# EAGLE schematic icyradio-main (EAGLE 9.6.2), part 1 of 3
CREVISION: 2; DESIGNER: Joao Silva

## Sheet 1 of 13: Compute Module 4
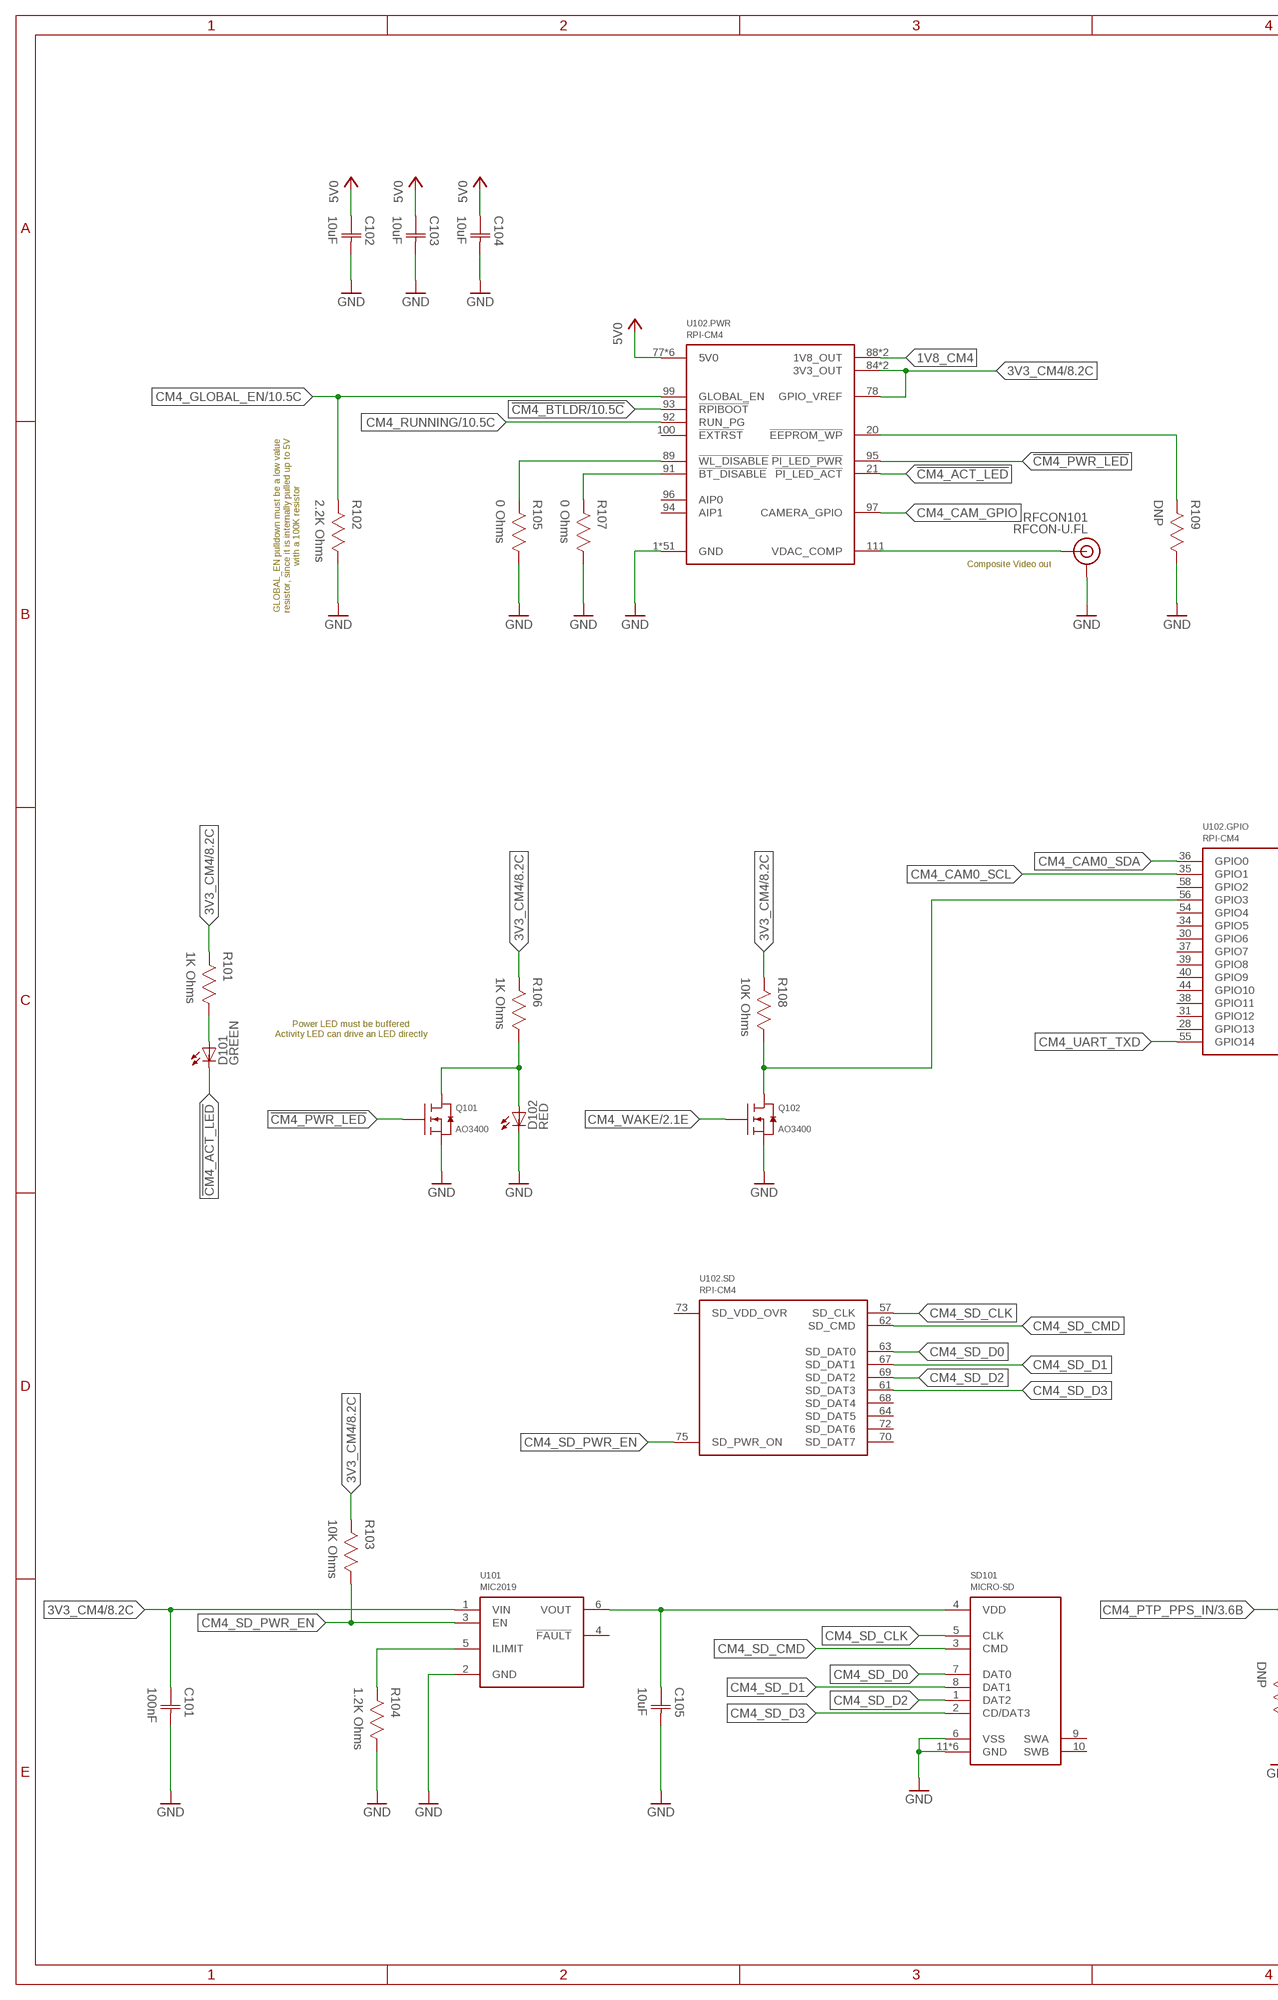
[diagram p0: schematic, sheet 1, part 1 of 2]
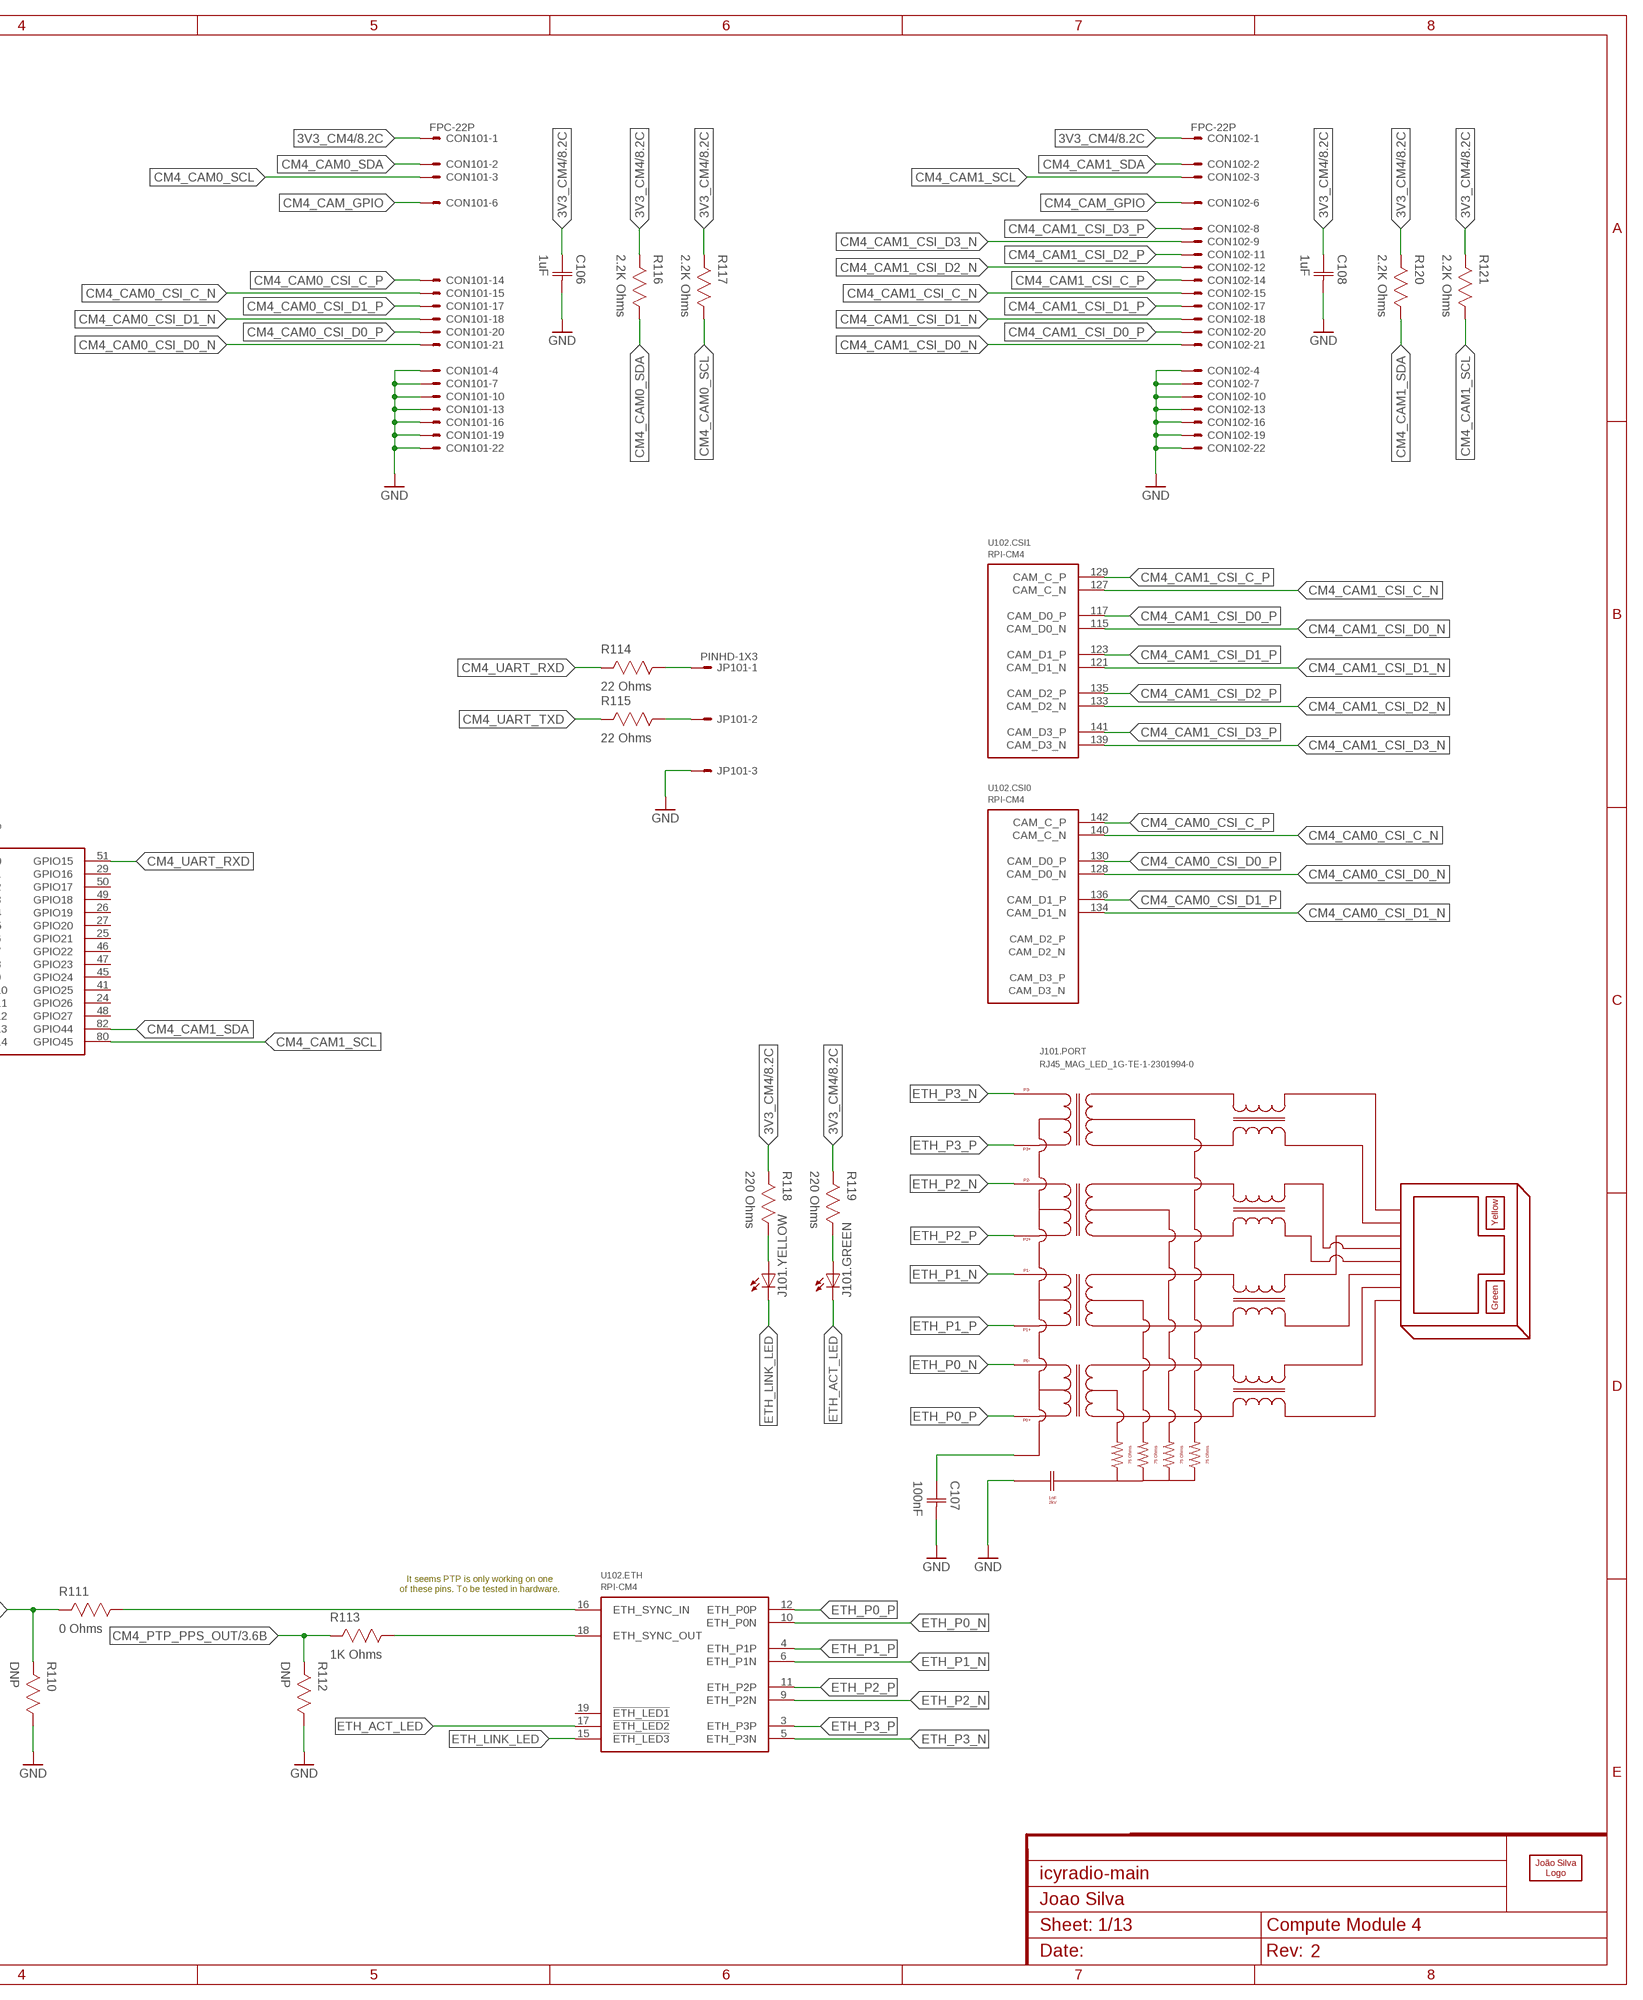
[diagram p1: schematic, sheet 1, part 2 of 2]

### Parts
C101  100nF  CAPACITOR-0402  [CAP0402]
C102  10uF  CAPACITOR-0603  [CAP0603]
C103  10uF  CAPACITOR-0603  [CAP0603]
C104  10uF  CAPACITOR-0603  [CAP0603]
C105  10uF  CAPACITOR-0402  [CAP0402]
C106  1uF  CAPACITOR-0402  [CAP0402]
C107  100nF  CAPACITOR-0402  [CAP0402]
C108  1uF  CAPACITOR-0402  [CAP0402]
CON101  FPC-22P  [FPC-22P]
CON102  FPC-22P  [FPC-22P]
D101  LED0603  [0603]
D102  LED0603  [0603]
J101  RJ45_MAG_LED_1G-TE-1-2301994-0  [TE-1-2301994-0]
JP101  PINHD-1X3  [1X03]
LOGO101  JS-10MM  [JS_10MM]
Q101  AO3400  [SOT23]
Q102  AO3400  [SOT23]
R101  1K Ohms  RESISTOR-0402  [RES0402]
R102  2.2K Ohms  RESISTOR-0402  [RES0402]
R103  10K Ohms  RESISTOR-0402  [RES0402]
R104  1.2K Ohms  RESISTOR-0402  [RES0402]
R105  0 Ohms  RESISTOR-0402  [RES0402]
R106  1K Ohms  RESISTOR-0402  [RES0402]
R107  0 Ohms  RESISTOR-0402  [RES0402]
R108  10K Ohms  RESISTOR-0402  [RES0402]
R109  DNP  RESISTOR-0402  [RES0402]
R110  DNP  RESISTOR-0402  [RES0402]
R111  0 Ohms  RESISTOR-0402  [RES0402]
R112  DNP  RESISTOR-0402  [RES0402]
R113  1K Ohms  RESISTOR-0402  [RES0402]
R114  22 Ohms  RESISTOR-0402  [RES0402]
R115  22 Ohms  RESISTOR-0402  [RES0402]
R116  2.2K Ohms  RESISTOR-0402  [RES0402]
R117  2.2K Ohms  RESISTOR-0402  [RES0402]
R118  220 Ohms  RESISTOR-0402  [RES0402]
R119  220 Ohms  RESISTOR-0402  [RES0402]
R120  2.2K Ohms  RESISTOR-0402  [RES0402]
R121  2.2K Ohms  RESISTOR-0402  [RES0402]
RFCON101  RFCON-U.FL  [U.FL]
SD101  MICRO-SD  [TE-2201778-1]
U101  MIC2019  [SOT23-6]
U102  RPI-CM4  [RPI-CM4]

### Nets
1V8_CM4: U102.88(.PWR:1V8_OUT) U102.90(.PWR:1V8_OUT)
3V3_CM4: C101.1(C1) C106.1(C1) C108.1(C1) CON101.1 CON102.1 R101.2 R103.2 R106.2 R108.2 R116.2 R117.2 R118.2 R119.2 R120.2 R121.2 U101.1(VIN) U102.78(.PWR:GPIO_VREF) U102.84(.PWR:3V3_OUT) U102.86(.PWR:3V3_OUT) ; also sheet 8
3V3_CM4_SD: C105.1(C1) SD101.4(VDD) U101.6(VOUT)
5V0: C102.1(C1) C103.1(C1) C104.1(C1) U102.77(.PWR:5V0) U102.79(.PWR:5V0) U102.81(.PWR:5V0) U102.83(.PWR:5V0) U102.85(.PWR:5V0) U102.87(.PWR:5V0) ; also sheet 10,11,12
!CM4_ACT_LED: D101.C U102.21(.PWR:!PI_LED_ACT)
!CM4_BT_DIS: R107.2 U102.91(.PWR:!BT_DISABLE)
!CM4_BTLDR: U102.93(.PWR:!RPIBOOT) ; also sheet 10
!CM4_EE_WP: R109.2 U102.20(.PWR:!EEPROM_WP)
!CM4_PWR_LED: Q101.1(G) U102.95(.PWR:!PI_LED_PWR)
!CM4_WL_DIS: R105.2 U102.89(.PWR:!WL_DISABLE)
CM4_CAM0_CSI_C_N [CPWG 100 Ohm Differential]: CON101.15 U102.140(.CSI0:CAM_C_N)
CM4_CAM0_CSI_C_P [CPWG 100 Ohm Differential]: CON101.14 U102.142(.CSI0:CAM_C_P)
CM4_CAM0_CSI_D0_N [CPWG 100 Ohm Differential]: CON101.21 U102.128(.CSI0:CAM_D0_N)
CM4_CAM0_CSI_D0_P [CPWG 100 Ohm Differential]: CON101.20 U102.130(.CSI0:CAM_D0_P)
CM4_CAM0_CSI_D1_N [CPWG 100 Ohm Differential]: CON101.18 U102.134(.CSI0:CAM_D1_N)
CM4_CAM0_CSI_D1_P [CPWG 100 Ohm Differential]: CON101.17 U102.136(.CSI0:CAM_D1_P)
CM4_CAM0_SCL: CON101.3 R117.1 U102.35(.GPIO:GPIO1)
CM4_CAM0_SDA: CON101.2 R116.1 U102.36(.GPIO:GPIO0)
CM4_CAM1_CSI_C_N [CPWG 100 Ohm Differential]: CON102.15 U102.127(.CSI1:CAM_C_N)
CM4_CAM1_CSI_C_P [CPWG 100 Ohm Differential]: CON102.14 U102.129(.CSI1:CAM_C_P)
CM4_CAM1_CSI_D0_N [CPWG 100 Ohm Differential]: CON102.21 U102.115(.CSI1:CAM_D0_N)
CM4_CAM1_CSI_D0_P [CPWG 100 Ohm Differential]: CON102.20 U102.117(.CSI1:CAM_D0_P)
CM4_CAM1_CSI_D1_N [CPWG 100 Ohm Differential]: CON102.18 U102.121(.CSI1:CAM_D1_N)
CM4_CAM1_CSI_D1_P [CPWG 100 Ohm Differential]: CON102.17 U102.123(.CSI1:CAM_D1_P)
CM4_CAM1_CSI_D2_N [CPWG 100 Ohm Differential]: CON102.12 U102.133(.CSI1:CAM_D2_N)
CM4_CAM1_CSI_D2_P [CPWG 100 Ohm Differential]: CON102.11 U102.135(.CSI1:CAM_D2_P)
CM4_CAM1_CSI_D3_N [CPWG 100 Ohm Differential]: CON102.9 U102.139(.CSI1:CAM_D3_N)
CM4_CAM1_CSI_D3_P [CPWG 100 Ohm Differential]: CON102.8 U102.141(.CSI1:CAM_D3_P)
CM4_CAM1_SCL: CON102.3 R121.1 U102.80(.GPIO:GPIO45)
CM4_CAM1_SDA: CON102.2 R120.1 U102.82(.GPIO:GPIO44)
CM4_CAM_GPIO: CON101.6 CON102.6 U102.97(.PWR:CAMERA_GPIO)
CM4_CVBS [CPWG 50 Ohm Single-Ended]: RFCON101.P$3(SIGNAL) U102.111(.PWR:VDAC_COMP)
CM4_GLOBAL_EN: R102.2 U102.99(.PWR:GLOBAL_EN) ; also sheet 10
CM4_GPIO3: Q102.3(D) R108.1 U102.56(.GPIO:GPIO3)
CM4_PTP_PPS_IN: R110.2 R111.2 ; also sheet 3
CM4_PTP_PPS_OUT: R112.2 R113.2 ; also sheet 3
CM4_RUNNING: U102.92(.PWR:RUN_PG) ; also sheet 10
CM4_SD_CLK: SD101.5(CLK) U102.57(.SD:SD_CLK)
CM4_SD_CMD: SD101.3(CMD) U102.62(.SD:SD_CMD)
CM4_SD_D0: SD101.7(DAT0) U102.63(.SD:SD_DAT0)
CM4_SD_D1: SD101.8(DAT1) U102.67(.SD:SD_DAT1)
CM4_SD_D2: SD101.1(DAT2) U102.69(.SD:SD_DAT2)
CM4_SD_D3: SD101.2(CD/DAT3) U102.61(.SD:SD_DAT3)
CM4_SD_PWR_EN: R103.1 U101.3(EN) U102.75(.SD:SD_PWR_ON)
CM4_UART_RXD: R114.2 U102.51(.GPIO:GPIO15)
CM4_UART_TXD: R115.2 U102.55(.GPIO:GPIO14)
CM4_WAKE: Q102.1(G) ; also sheet 2
ETH_ACT_LED: J101.12(.GREEN:C) U102.17(.ETH:!ETH_LED2)
ETH_LINK_LED: J101.14(.YELLOW:C) U102.15(.ETH:!ETH_LED3)
ETH_P0_N [CPWG 100 Ohm Differential]: J101.3(.PORT:P0-) U102.10(.ETH:ETH_P0N)
ETH_P0_P [CPWG 100 Ohm Differential]: J101.2(.PORT:P0+) U102.12(.ETH:ETH_P0P)
ETH_P1_N [CPWG 100 Ohm Differential]: J101.7(.PORT:P1-) U102.6(.ETH:ETH_P1N)
ETH_P1_P [CPWG 100 Ohm Differential]: J101.4(.PORT:P1+) U102.4(.ETH:ETH_P1P)
ETH_P2_N [CPWG 100 Ohm Differential]: J101.6(.PORT:P2-) U102.9(.ETH:ETH_P2N)
ETH_P2_P [CPWG 100 Ohm Differential]: J101.5(.PORT:P2+) U102.11(.ETH:ETH_P2P)
ETH_P3_N [CPWG 100 Ohm Differential]: J101.9(.PORT:P3-) U102.5(.ETH:ETH_P3N)
ETH_P3_P [CPWG 100 Ohm Differential]: J101.8(.PORT:P3+) U102.3(.ETH:ETH_P3P)
ETH_SYNC_IN: R111.1 U102.16(.ETH:ETH_SYNC_IN)
ETH_SYNC_OUT: R113.1 U102.18(.ETH:ETH_SYNC_OUT)
GND: C101.2(C2) C102.2(C2) C103.2(C2) C104.2(C2) C105.2(C2) C106.2(C2) C107.2(C2) C108.2(C2) CON101.4 CON101.7 CON101.10 CON101.13 CON101.16 CON101.19 CON101.22 CON102.4 CON102.7 CON102.10 CON102.13 CON102.16 CON102.19 CON102.22 D102.C J101.10(.PORT:CHS_GND) J101.SHIELD@0(.PORT:CHS_GND) J101.SHIELD@1(.PORT:CHS_GND) JP101.3 Q101.2(S) Q102.2(S) R102.1 R104.1 R105.1 R107.1 R109.1 R110.1 R112.1 RFCON101.P$1(GND) RFCON101.P$2(GND) SD101.6(VSS) SD101.11(GND) SD101.12(GND) SD101.13(GND) SD101.14(GND) SD101.15(GND) SD101.16(GND) U101.2(GND) U102.1(.PWR:GND) U102.2(.PWR:GND) U102.7(.PWR:GND) U102.8(.PWR:GND) U102.13(.PWR:GND) U102.14(.PWR:GND) U102.22(.PWR:GND) U102.23(.PWR:GND) U102.32(.PWR:GND) U102.33(.PWR:GND) U102.42(.PWR:GND) U102.43(.PWR:GND) U102.52(.PWR:GND) U102.53(.PWR:GND) U102.59(.PWR:GND) U102.60(.PWR:GND) U102.65(.PWR:GND) U102.66(.PWR:GND) U102.71(.PWR:GND) U102.74(.PWR:GND) U102.98(.PWR:GND) U102.107(.PWR:GND) U102.108(.PWR:GND) U102.113(.PWR:GND) U102.114(.PWR:GND) U102.119(.PWR:GND) U102.120(.PWR:GND) U102.125(.PWR:GND) U102.126(.PWR:GND) U102.131(.PWR:GND) U102.132(.PWR:GND) U102.137(.PWR:GND) U102.138(.PWR:GND) U102.144(.PWR:GND) U102.150(.PWR:GND) U102.155(.PWR:GND) U102.156(.PWR:GND) U102.161(.PWR:GND) U102.162(.PWR:GND) U102.167(.PWR:GND) U102.168(.PWR:GND) U102.173(.PWR:GND) U102.174(.PWR:GND) U102.179(.PWR:GND) U102.180(.PWR:GND) U102.185(.PWR:GND) U102.186(.PWR:GND) U102.191(.PWR:GND) U102.192(.PWR:GND) U102.197(.PWR:GND) U102.198(.PWR:GND) ; also sheet 2,3,4,5,6,7,8,9,10,11,12
N$2: JP101.1 R114.1
N$6: JP101.2 R115.1
N$40: C107.1(C1) J101.1(.PORT:CT)
N$48: J101.11(.GREEN:A) R119.1
N$50: J101.13(.YELLOW:A) R118.1
N$74: R104.2 U101.5(ILIMIT)
N$121: D101.A R101.1
N$123: D102.A Q101.3(D) R106.1
Unconnected: CON101.5 CON101.8 CON101.9 CON101.11 CON101.12 CON102.5 SD101.9(SWA) SD101.10(SWB) U101.4(!FAULT) U102.19(.ETH:!ETH_LED1) U102.24(.GPIO:GPIO26) U102.25(.GPIO:GPIO21) U102.26(.GPIO:GPIO19) U102.27(.GPIO:GPIO20) U102.28(.GPIO:GPIO13) U102.29(.GPIO:GPIO16) U102.30(.GPIO:GPIO6) U102.31(.GPIO:GPIO12) U102.34(.GPIO:GPIO5) U102.37(.GPIO:GPIO7) U102.38(.GPIO:GPIO11) U102.39(.GPIO:GPIO8) U102.40(.GPIO:GPIO9) U102.41(.GPIO:GPIO25) U102.44(.GPIO:GPIO10) U102.45(.GPIO:GPIO24) U102.46(.GPIO:GPIO22) U102.47(.GPIO:GPIO23) U102.48(.GPIO:GPIO27) U102.49(.GPIO:GPIO18) U102.50(.GPIO:GPIO17) U102.54(.GPIO:GPIO4) U102.58(.GPIO:GPIO2) U102.64(.SD:SD_DAT5) U102.68(.SD:SD_DAT4) U102.70(.SD:SD_DAT7) U102.72(.SD:SD_DAT6) U102.73(.SD:SD_VDD_OVR) U102.94(.PWR:AIP1) U102.96(.PWR:AIP0) U102.100(.PWR:!EXTRST) U102.143(.HDMI1:HDMI_HOTPLUG) U102.145(.HDMI1:HDMI_SDA) U102.146(.HDMI1:HDMI_TX2_P) U102.147(.HDMI1:HDMI_SCL) U102.148(.HDMI1:HDMI_TX2_N) U102.149(.HDMI1:HDMI_CEC) U102.151(.HDMI0:HDMI_CEC) U102.152(.HDMI1:HDMI_TX1_P) U102.153(.HDMI0:HDMI_HOTPLUG) U102.154(.HDMI1:HDMI_TX1_N) U102.157(.DSI0:DSI_D0_N) U102.158(.HDMI1:HDMI_TX0_P) U102.159(.DSI0:DSI_D0_P) U102.160(.HDMI1:HDMI_TX0_N) U102.163(.DSI0:DSI_D1_N) U102.164(.HDMI1:HDMI_CLK_P) U102.165(.DSI0:DSI_D1_P) U102.166(.HDMI1:HDMI_CLK_N) U102.169(.DSI0:DSI_C_N) U102.170(.HDMI0:HDMI_TX2_P) U102.171(.DSI0:DSI_C_P) U102.172(.HDMI0:HDMI_TX2_N) U102.175(.DSI1:DSI_D0_N) U102.176(.HDMI0:HDMI_TX1_P) U102.177(.DSI1:DSI_D0_P) U102.178(.HDMI0:HDMI_TX1_N) U102.181(.DSI1:DSI_D1_N) U102.182(.HDMI0:HDMI_TX0_P) U102.183(.DSI1:DSI_D1_P) U102.184(.HDMI0:HDMI_TX0_N) U102.187(.DSI1:DSI_C_N) U102.188(.HDMI0:HDMI_CLK_P) U102.189(.DSI1:DSI_C_P) U102.190(.HDMI0:HDMI_CLK_N) U102.193(.DSI1:DSI_D2_N) U102.194(.DSI1:DSI_D3_N) U102.195(.DSI1:DSI_D2_P) U102.196(.DSI1:DSI_D3_P) U102.199(.HDMI0:HDMI_SDA) U102.200(.HDMI0:HDMI_SCL)

### Notes on the sheet
- GLOBAL_EN pulldown must be a low value
  resistor, since it is internally pulled up to 5V
  with a 100K resistor
- Composite Video out
- Power LED must be buffered
  Activity LED can drive an LED directly
- It seems PTP is only working on one
  of these pins. To be tested in hardware.

## Sheet 2 of 13: FPGA
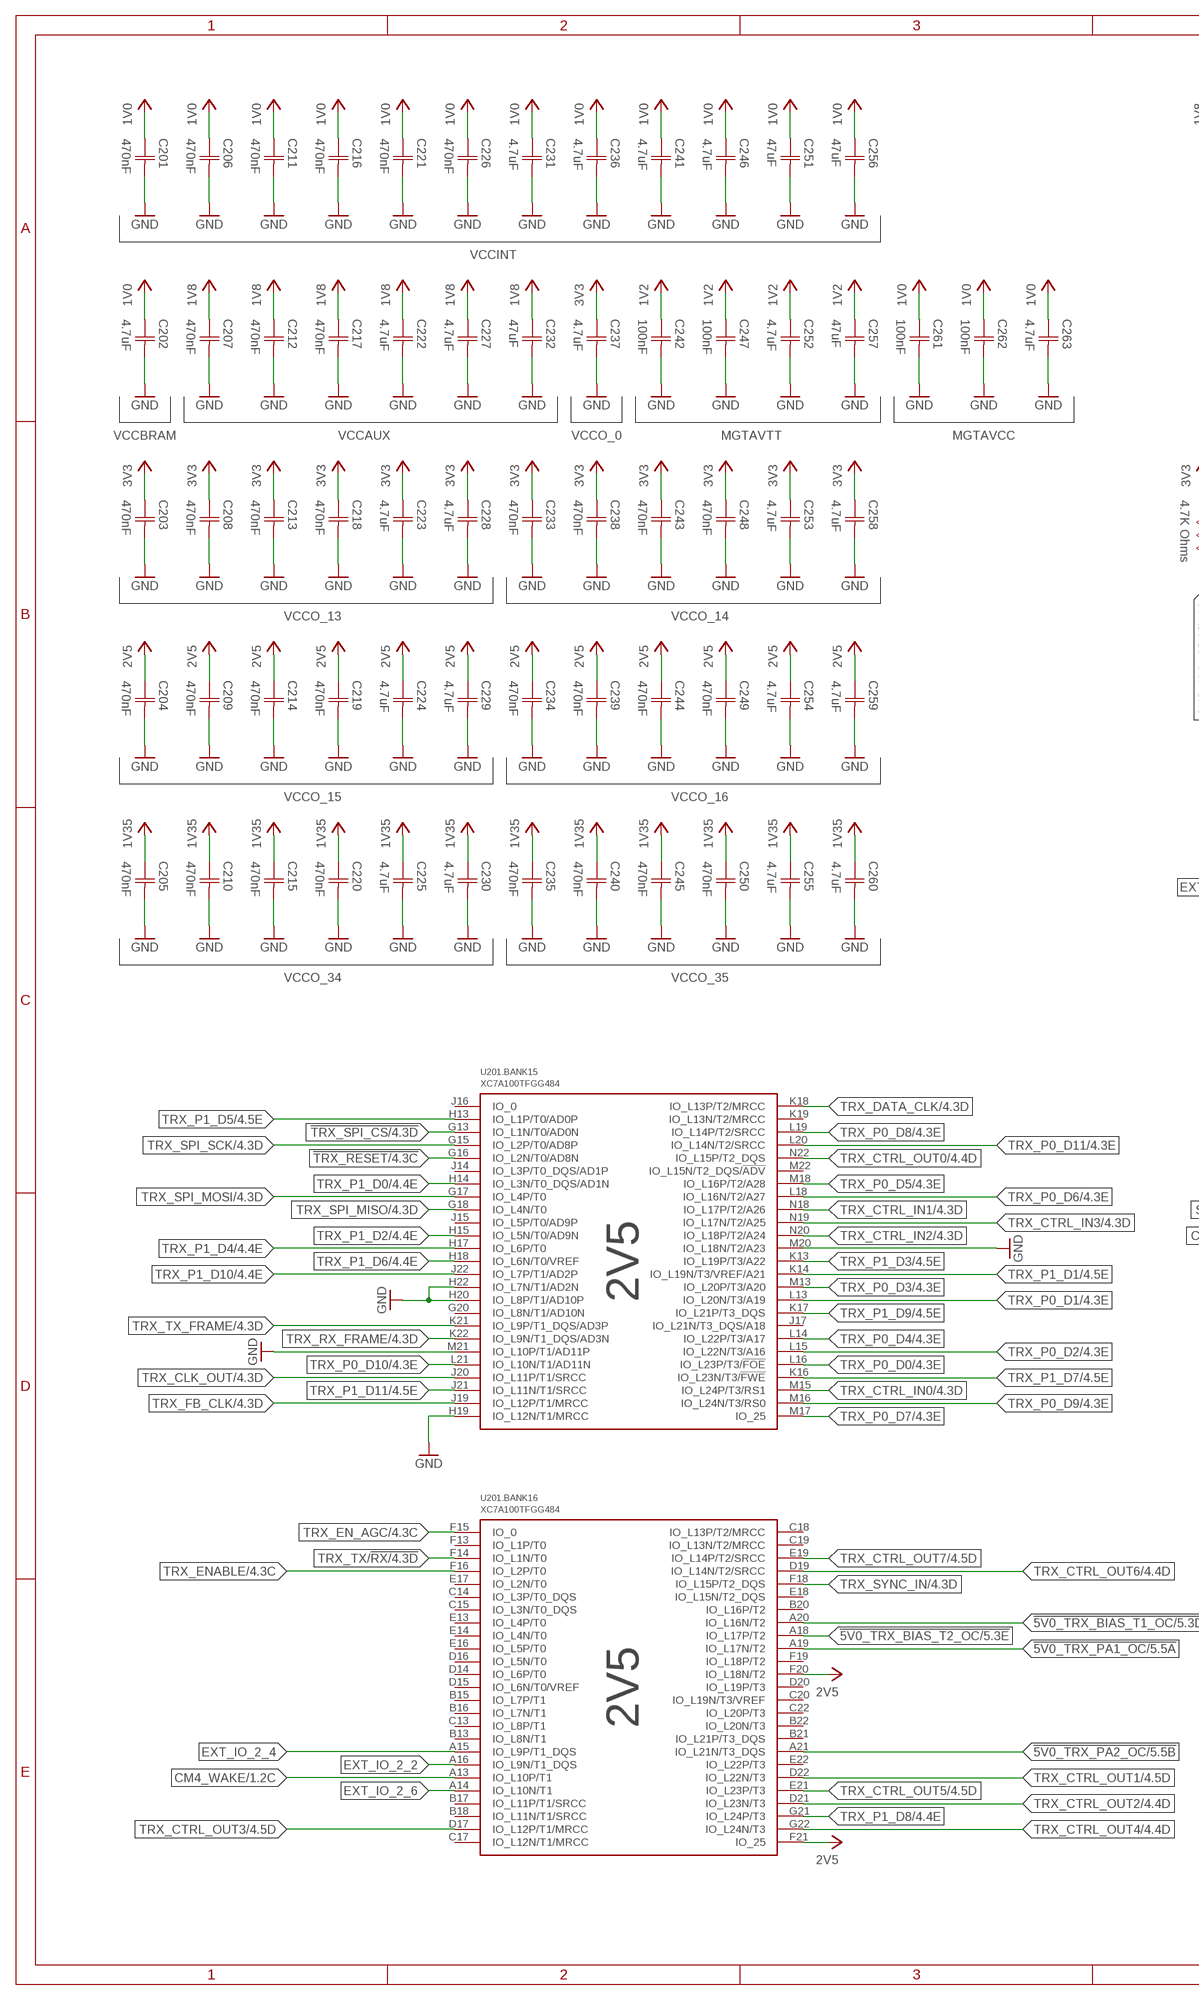
[diagram p2: schematic, sheet 2, part 1 of 2]
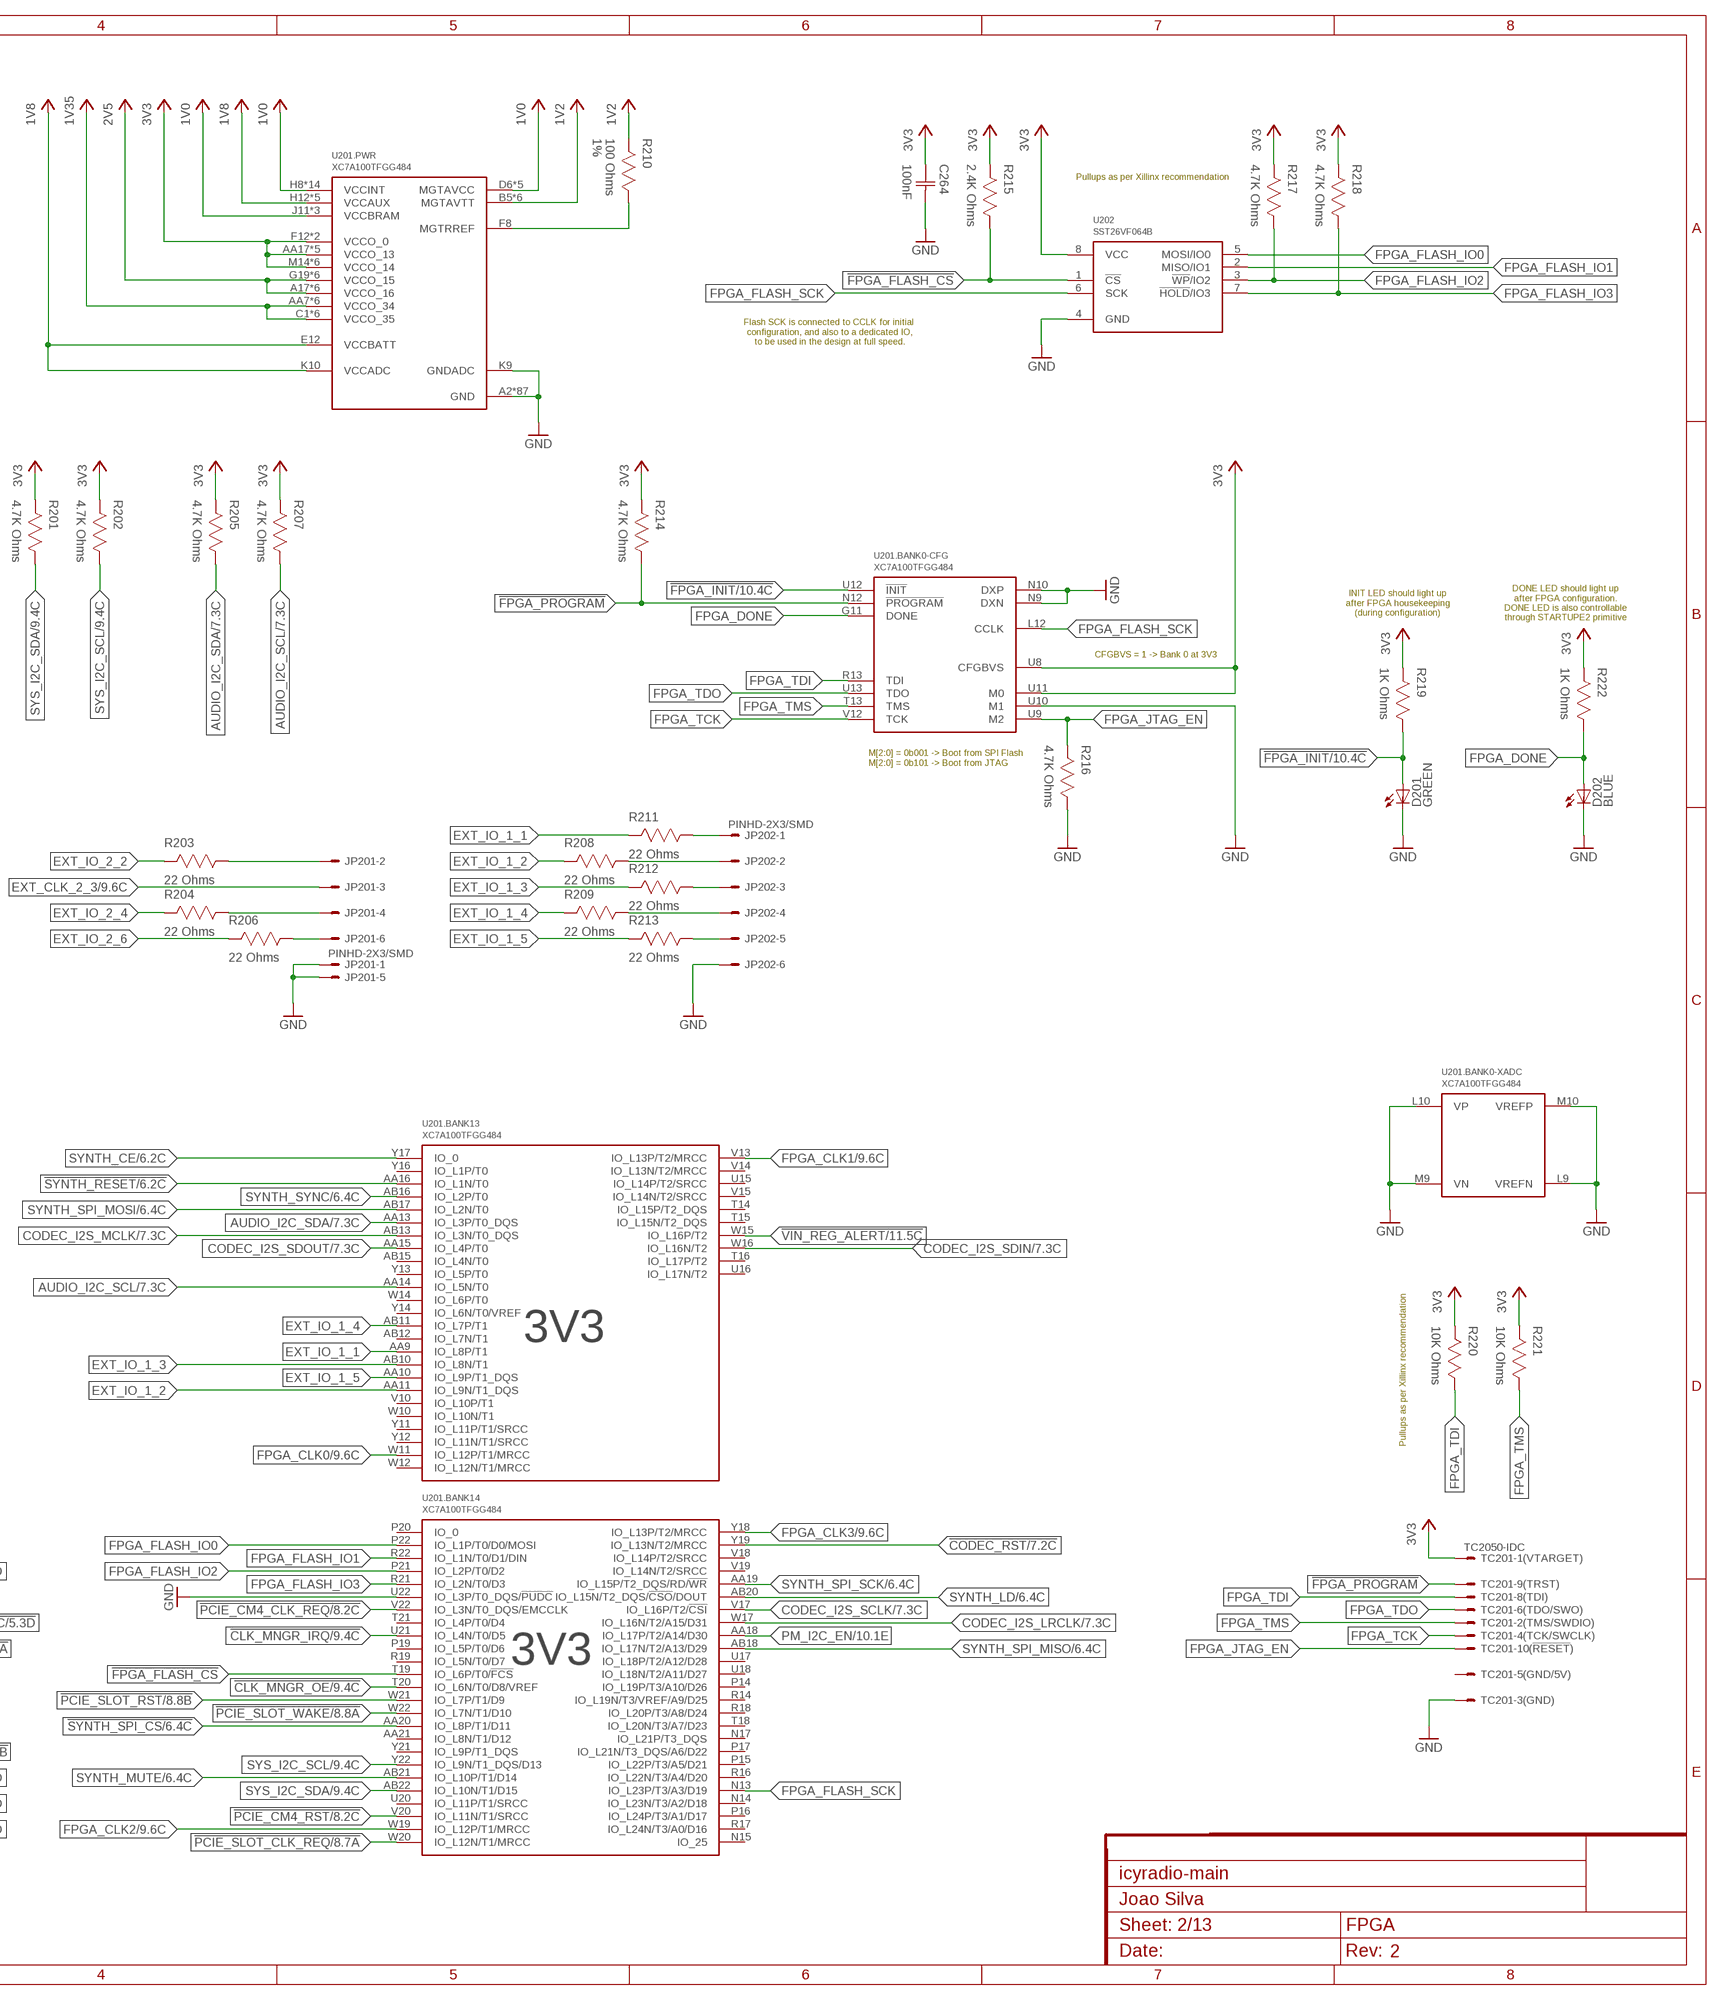
[diagram p3: schematic, sheet 2, part 2 of 2]

### Parts
C201  470nF  CAPACITOR-0402  [CAP0402]
C202  4.7uF  CAPACITOR-0402  [CAP0402]
C203  470nF  CAPACITOR-0402  [CAP0402]
C204  470nF  CAPACITOR-0402  [CAP0402]
C205  470nF  CAPACITOR-0402  [CAP0402]
C206  470nF  CAPACITOR-0402  [CAP0402]
C207  470nF  CAPACITOR-0402  [CAP0402]
C208  470nF  CAPACITOR-0402  [CAP0402]
C209  470nF  CAPACITOR-0402  [CAP0402]
C210  470nF  CAPACITOR-0402  [CAP0402]
C211  470nF  CAPACITOR-0402  [CAP0402]
C212  470nF  CAPACITOR-0402  [CAP0402]
C213  470nF  CAPACITOR-0402  [CAP0402]
C214  470nF  CAPACITOR-0402  [CAP0402]
C215  470nF  CAPACITOR-0402  [CAP0402]
C216  470nF  CAPACITOR-0402  [CAP0402]
C217  470nF  CAPACITOR-0402  [CAP0402]
C218  470nF  CAPACITOR-0402  [CAP0402]
C219  470nF  CAPACITOR-0402  [CAP0402]
C220  470nF  CAPACITOR-0402  [CAP0402]
C221  470nF  CAPACITOR-0402  [CAP0402]
C222  4.7uF  CAPACITOR-0402  [CAP0402]
C223  4.7uF  CAPACITOR-0402  [CAP0402]
C224  4.7uF  CAPACITOR-0402  [CAP0402]
C225  4.7uF  CAPACITOR-0402  [CAP0402]
C226  470nF  CAPACITOR-0402  [CAP0402]
C227  4.7uF  CAPACITOR-0402  [CAP0402]
C228  4.7uF  CAPACITOR-0402  [CAP0402]
C229  4.7uF  CAPACITOR-0402  [CAP0402]
C230  4.7uF  CAPACITOR-0402  [CAP0402]
C231  4.7uF  CAPACITOR-0402  [CAP0402]
C232  47uF  CAPACITOR-0603  [CAP0603]
C233  470nF  CAPACITOR-0402  [CAP0402]
C234  470nF  CAPACITOR-0402  [CAP0402]
C235  470nF  CAPACITOR-0402  [CAP0402]
C236  4.7uF  CAPACITOR-0402  [CAP0402]
C237  4.7uF  CAPACITOR-0402  [CAP0402]
C238  470nF  CAPACITOR-0402  [CAP0402]
C239  470nF  CAPACITOR-0402  [CAP0402]
C240  470nF  CAPACITOR-0402  [CAP0402]
C241  4.7uF  CAPACITOR-0402  [CAP0402]
C242  100nF  CAPACITOR-0402  [CAP0402]
C243  470nF  CAPACITOR-0402  [CAP0402]
C244  470nF  CAPACITOR-0402  [CAP0402]
C245  470nF  CAPACITOR-0402  [CAP0402]
C246  4.7uF  CAPACITOR-0402  [CAP0402]
C247  100nF  CAPACITOR-0402  [CAP0402]
C248  470nF  CAPACITOR-0402  [CAP0402]
C249  470nF  CAPACITOR-0402  [CAP0402]
C250  470nF  CAPACITOR-0402  [CAP0402]
C251  47uF  CAPACITOR-0603  [CAP0603]
C252  4.7uF  CAPACITOR-0402  [CAP0402]
C253  4.7uF  CAPACITOR-0402  [CAP0402]
C254  4.7uF  CAPACITOR-0402  [CAP0402]
C255  4.7uF  CAPACITOR-0402  [CAP0402]
C256  47uF  CAPACITOR-0603  [CAP0603]
C257  47uF  CAPACITOR-0603  [CAP0603]
C258  4.7uF  CAPACITOR-0402  [CAP0402]
C259  4.7uF  CAPACITOR-0402  [CAP0402]
C260  4.7uF  CAPACITOR-0402  [CAP0402]
C261  100nF  CAPACITOR-0402  [CAP0402]
C262  100nF  CAPACITOR-0402  [CAP0402]
C263  4.7uF  CAPACITOR-0402  [CAP0402]
C264  100nF  CAPACITOR-0402  [CAP0402]
D201  LED0603  [0603]
D202  LED0603  [0603]
JP201  PINHD-2X3/SMD  [2X03/SMD]
JP202  PINHD-2X3/SMD  [2X03/SMD]
R201  4.7K Ohms  RESISTOR-0402  [RES0402]
R202  4.7K Ohms  RESISTOR-0402  [RES0402]
R203  22 Ohms  RESISTOR-0402  [RES0402]
R204  22 Ohms  RESISTOR-0402  [RES0402]
R205  4.7K Ohms  RESISTOR-0402  [RES0402]
R206  22 Ohms  RESISTOR-0402  [RES0402]
R207  4.7K Ohms  RESISTOR-0402  [RES0402]
R208  22 Ohms  RESISTOR-0402  [RES0402]
R209  22 Ohms  RESISTOR-0402  [RES0402]
R210  100 Ohms  RESISTOR-0402  [RES0402]
R211  22 Ohms  RESISTOR-0402  [RES0402]
R212  22 Ohms  RESISTOR-0402  [RES0402]
R213  22 Ohms  RESISTOR-0402  [RES0402]
R214  4.7K Ohms  RESISTOR-0402  [RES0402]
R215  2.4K Ohms  RESISTOR-0402  [RES0402]
R216  4.7K Ohms  RESISTOR-0402  [RES0402]
R217  4.7K Ohms  RESISTOR-0402  [RES0402]
R218  4.7K Ohms  RESISTOR-0402  [RES0402]
R219  1K Ohms  RESISTOR-0402  [RES0402]
R220  10K Ohms  RESISTOR-0402  [RES0402]
R221  10K Ohms  RESISTOR-0402  [RES0402]
R222  1K Ohms  RESISTOR-0402  [RES0402]
TC201  TC2050-IDC  [TC2050-IDC]
U201  XC7A100TFGG484  [FGG484]
U202  SST26VF064B  [WSOIC8]

### Nets
1V0: C201.1(C1) C202.1(C1) C206.1(C1) C211.1(C1) C216.1(C1) C221.1(C1) C226.1(C1) C231.1(C1) C236.1(C1) C241.1(C1) C246.1(C1) C251.1(C1) C256.1(C1) C261.1(C1) C262.1(C1) C263.1(C1) U201.D6(.PWR:MGTAVCC) U201.D10(.PWR:MGTAVCC) U201.E8(.PWR:MGTAVCC) U201.F7(.PWR:MGTAVCC) U201.F9(.PWR:MGTAVCC) U201.H8(.PWR:VCCINT) U201.H10(.PWR:VCCINT) U201.J7(.PWR:VCCINT) U201.J9(.PWR:VCCINT) U201.J11(.PWR:VCCBRAM) U201.K8(.PWR:VCCINT) U201.L7(.PWR:VCCINT) U201.L11(.PWR:VCCBRAM) U201.M8(.PWR:VCCINT) U201.N7(.PWR:VCCINT) U201.N11(.PWR:VCCBRAM) U201.P8(.PWR:VCCINT) U201.P10(.PWR:VCCINT) U201.R7(.PWR:VCCINT) U201.R9(.PWR:VCCINT) U201.T8(.PWR:VCCINT) U201.T10(.PWR:VCCINT) ; also sheet 11
1V2: C242.1(C1) C247.1(C1) C252.1(C1) C257.1(C1) R210.2 U201.B5(.PWR:MGTAVTT) U201.B7(.PWR:MGTAVTT) U201.B9(.PWR:MGTAVTT) U201.B11(.PWR:MGTAVTT) U201.C4(.PWR:MGTAVTT) U201.C8(.PWR:MGTAVTT) ; also sheet 12
1V8: C207.1(C1) C212.1(C1) C217.1(C1) C222.1(C1) C227.1(C1) C232.1(C1) U201.E12(.PWR:VCCBATT) U201.H12(.PWR:VCCAUX) U201.K10(.PWR:VCCADC) U201.K12(.PWR:VCCAUX) U201.M12(.PWR:VCCAUX) U201.P12(.PWR:VCCAUX) U201.R11(.PWR:VCCAUX) ; also sheet 12
1V35: C205.1(C1) C210.1(C1) C215.1(C1) C220.1(C1) C225.1(C1) C230.1(C1) C235.1(C1) C240.1(C1) C245.1(C1) C250.1(C1) C255.1(C1) C260.1(C1) U201.AA7(.PWR:VCCO_34) U201.AB4(.PWR:VCCO_34) U201.C1(.PWR:VCCO_35) U201.F2(.PWR:VCCO_35) U201.H6(.PWR:VCCO_35) U201.J3(.PWR:VCCO_35) U201.M4(.PWR:VCCO_35) U201.N1(.PWR:VCCO_35) U201.R5(.PWR:VCCO_34) U201.T2(.PWR:VCCO_34) U201.V6(.PWR:VCCO_34) U201.W3(.PWR:VCCO_34) ; also sheet 3,12
2V5: C204.1(C1) C209.1(C1) C214.1(C1) C219.1(C1) C224.1(C1) C229.1(C1) C234.1(C1) C239.1(C1) C244.1(C1) C249.1(C1) C254.1(C1) C259.1(C1) U201.A17(.PWR:VCCO_16) U201.B14(.PWR:VCCO_16) U201.C21(.PWR:VCCO_16) U201.D18(.PWR:VCCO_16) U201.E15(.PWR:VCCO_16) U201.F20(.BANK16:IO_L18N/T2) U201.F21(.BANK16:IO_25) U201.F22(.PWR:VCCO_16) U201.G19(.PWR:VCCO_15) U201.H16(.PWR:VCCO_15) U201.J13(.PWR:VCCO_15) U201.K20(.PWR:VCCO_15) U201.L17(.PWR:VCCO_15) U201.N21(.PWR:VCCO_15) ; also sheet 4,5,11,12
3V3: C203.1(C1) C208.1(C1) C213.1(C1) C218.1(C1) C223.1(C1) C228.1(C1) C233.1(C1) C237.1(C1) C238.1(C1) C243.1(C1) C248.1(C1) C253.1(C1) C258.1(C1) C264.1(C1) R201.2 R202.2 R205.2 R207.2 R214.2 R215.2 R217.2 R218.2 R219.2 R220.2 R221.2 R222.2 TC201.1 U201.AA17(.PWR:VCCO_13) U201.AB14(.PWR:VCCO_13) U201.F12(.PWR:VCCO_0) U201.M14(.PWR:VCCO_14) U201.P18(.PWR:VCCO_14) U201.R15(.PWR:VCCO_14) U201.T12(.PWR:VCCO_0) U201.T22(.PWR:VCCO_14) U201.U8(.BANK0-CFG:CFGBVS) U201.U11(.BANK0-CFG:M0) U201.U19(.PWR:VCCO_14) U201.V16(.PWR:VCCO_13) U201.W13(.PWR:VCCO_13) U201.Y10(.PWR:VCCO_13) U201.Y20(.PWR:VCCO_14) U202.8(VCC) ; also sheet 7,8,9,10,11,12
!5V0_TRX_BIAS_T1_OC: U201.A20(.BANK16:IO_L16N/T2) ; also sheet 5
!5V0_TRX_BIAS_T2_OC: U201.A18(.BANK16:IO_L17P/T2) ; also sheet 5
!5V0_TRX_PA1_OC: U201.A19(.BANK16:IO_L17N/T2) ; also sheet 5
!5V0_TRX_PA2_OC: U201.A21(.BANK16:IO_L21N/T3_DQS) ; also sheet 5
!CLK_MNGR_IRQ: U201.U21(.BANK14:IO_L4N/T0/D5) ; also sheet 9
!CLK_MNGR_OE: U201.T20(.BANK14:IO_L6N/T0/D8/VREF) ; also sheet 9
!CODEC_RST: U201.Y19(.BANK14:IO_L13N/T2/MRCC) ; also sheet 7
!FPGA_FLASH_CS: R215.1 U201.T19(.BANK14:IO_L6P/T0/!FCS) U202.1(!CS!)
!FPGA_INIT: D201.A R219.1 U201.U12(.BANK0-CFG:!INIT) ; also sheet 10
!FPGA_PROGRAM: R214.1 TC201.9 U201.N12(.BANK0-CFG:!PROGRAM)
!PCIE_CM4_CLK_REQ: U201.V22(.BANK14:IO_L3N/T0_DQS/EMCCLK) ; also sheet 8
!PCIE_CM4_RST: U201.V20(.BANK14:IO_L11N/T1/SRCC) ; also sheet 8
!PCIE_SLOT_CLK_REQ: U201.W20(.BANK14:IO_L12N/T1/MRCC) ; also sheet 8
!PCIE_SLOT_RST: U201.W21(.BANK14:IO_L7P/T1/D9) ; also sheet 8
!PCIE_SLOT_WAKE: U201.W22(.BANK14:IO_L7N/T1/D10) ; also sheet 8
!SYNTH_RESET: U201.AA16(.BANK13:IO_L1N/T0) ; also sheet 6
!SYNTH_SPI_CS: U201.AA20(.BANK14:IO_L8P/T1/D11) ; also sheet 6
!TRX_RESET: U201.G16(.BANK15:IO_L2N/T0/AD8N) ; also sheet 4
!TRX_SPI_CS: U201.G13(.BANK15:IO_L1N/T0/AD0N) ; also sheet 4
!VIN_REG_ALERT: U201.W15(.BANK13:IO_L16P/T2) ; also sheet 11
AUDIO_I2C_SCL: R207.1 U201.AA14(.BANK13:IO_L5N/T0) ; also sheet 7
AUDIO_I2C_SDA: R205.1 U201.AA13(.BANK13:IO_L3P/T0_DQS) ; also sheet 7
CM4_WAKE: U201.A13(.BANK16:IO_L10P/T1) ; also sheet 1
CODEC_I2S_LRCLK: U201.W17(.BANK14:IO_L16N/T2/A15/D31) ; also sheet 7
CODEC_I2S_MCLK: U201.AB13(.BANK13:IO_L3N/T0_DQS) ; also sheet 7
CODEC_I2S_SCLK: U201.V17(.BANK14:IO_L16P/T2/!CSI) ; also sheet 7
CODEC_I2S_SDIN: U201.W16(.BANK13:IO_L16N/T2) ; also sheet 7
CODEC_I2S_SDOUT: U201.AA15(.BANK13:IO_L4P/T0) ; also sheet 7
EXT_CLK_2_3 [CPWG 50 Ohm Single-Ended]: JP201.3 ; also sheet 9
EXT_IO_1_1: R211.2 U201.AA9(.BANK13:IO_L8P/T1)
EXT_IO_1_2: R208.2 U201.AA11(.BANK13:IO_L9N/T1_DQS)
EXT_IO_1_3: R212.2 U201.AB10(.BANK13:IO_L8N/T1)
EXT_IO_1_4: R209.2 U201.AB11(.BANK13:IO_L7P/T1)
EXT_IO_1_5: R213.2 U201.AA10(.BANK13:IO_L9P/T1_DQS)
EXT_IO_2_2: R203.2 U201.A16(.BANK16:IO_L9N/T1_DQS)
EXT_IO_2_4: R204.2 U201.A15(.BANK16:IO_L9P/T1_DQS)
EXT_IO_2_6: R206.2 U201.A14(.BANK16:IO_L10N/T1)
FPGA_CLK0: U201.W11(.BANK13:IO_L12P/T1/MRCC) ; also sheet 9
FPGA_CLK1: U201.V13(.BANK13:IO_L13P/T2/MRCC) ; also sheet 9
FPGA_CLK2: U201.W19(.BANK14:IO_L12P/T1/MRCC) ; also sheet 9
FPGA_CLK3: U201.Y18(.BANK14:IO_L13P/T2/MRCC) ; also sheet 9
FPGA_DONE: D202.A R222.1 U201.G11(.BANK0-CFG:DONE)
FPGA_FLASH_IO0: U201.P22(.BANK14:IO_L1P/T0/D0/MOSI) U202.5(MOSI/IO0)
FPGA_FLASH_IO1: U201.R22(.BANK14:IO_L1N/T0/D1/DIN) U202.2(MISO/IO1)
FPGA_FLASH_IO2: R217.1 U201.P21(.BANK14:IO_L2P/T0/D2) U202.3(!WP!/IO2)
FPGA_FLASH_IO3: R218.1 U201.R21(.BANK14:IO_L2N/T0/D3) U202.7(!HOLD!/IO3)
FPGA_FLASH_SCK: U201.L12(.BANK0-CFG:CCLK) U201.N13(.BANK14:IO_L23P/T3/A3/D19) U202.6(SCK)
FPGA_JTAG_EN: R216.2 TC201.10 U201.U9(.BANK0-CFG:M2)
FPGA_TCK: TC201.4 U201.V12(.BANK0-CFG:TCK)
FPGA_TDI: R220.1 TC201.8 U201.R13(.BANK0-CFG:TDI)
FPGA_TDO: TC201.6 U201.U13(.BANK0-CFG:TDO)
FPGA_TMS: R221.1 TC201.2 U201.T13(.BANK0-CFG:TMS)
GND: C201.2(C2) C202.2(C2) C203.2(C2) C204.2(C2) C205.2(C2) C206.2(C2) C207.2(C2) C208.2(C2) C209.2(C2) C210.2(C2) C211.2(C2) C212.2(C2) C213.2(C2) C214.2(C2) C215.2(C2) C216.2(C2) C217.2(C2) C218.2(C2) C219.2(C2) C220.2(C2) C221.2(C2) C222.2(C2) C223.2(C2) C224.2(C2) C225.2(C2) C226.2(C2) C227.2(C2) C228.2(C2) C229.2(C2) C230.2(C2) C231.2(C2) C232.2(C2) C233.2(C2) C234.2(C2) C235.2(C2) C236.2(C2) C237.2(C2) C238.2(C2) C239.2(C2) C240.2(C2) C241.2(C2) C242.2(C2) C243.2(C2) C244.2(C2) C245.2(C2) C246.2(C2) C247.2(C2) C248.2(C2) C249.2(C2) C250.2(C2) C251.2(C2) C252.2(C2) C253.2(C2) C254.2(C2) C255.2(C2) C256.2(C2) C257.2(C2) C258.2(C2) C259.2(C2) C260.2(C2) C261.2(C2) C262.2(C2) C263.2(C2) C264.2(C2) D201.C D202.C JP201.1 JP201.5 JP202.6 R216.1 TC201.3 U201.A2(.PWR:GND) U201.A3(.PWR:GND) U201.A5(.PWR:GND) U201.A7(.PWR:GND) U201.A9(.PWR:GND) U201.A11(.PWR:GND) U201.A12(.PWR:GND) U201.A22(.PWR:GND) U201.AA2(.PWR:GND) U201.AA12(.PWR:GND) U201.AA22(.PWR:GND) U201.AB9(.PWR:GND) U201.AB19(.PWR:GND) U201.B3(.PWR:GND) U201.B12(.PWR:GND) U201.B19(.PWR:GND) U201.C3(.PWR:GND) U201.C6(.PWR:GND) U201.C10(.PWR:GND) U201.C12(.PWR:GND) U201.C16(.PWR:GND) U201.D3(.PWR:GND) U201.D4(.PWR:GND) U201.D8(.PWR:GND) U201.D12(.PWR:GND) U201.D13(.PWR:GND) U201.E4(.PWR:GND) U201.E5(.PWR:GND) U201.E7(.PWR:GND) U201.E9(.PWR:GND) U201.E11(.PWR:GND) U201.E20(.PWR:GND) U201.F5(.PWR:GND) U201.F11(.PWR:GND) U201.F17(.PWR:GND) U201.G5(.PWR:GND) U201.G6(.PWR:GND) U201.G7(.PWR:GND) U201.G8(.PWR:GND) U201.G9(.PWR:GND) U201.G10(.PWR:GND) U201.G12(.PWR:GND) U201.G14(.PWR:GND) U201.H1(.PWR:GND) U201.H7(.PWR:GND) U201.H9(.PWR:GND) U201.H11(.PWR:GND) U201.H19(.BANK15:IO_L12N/T1/MRCC) U201.H20(.BANK15:IO_L8P/T1/AD10P) U201.H21(.PWR:GND) U201.H22(.BANK15:IO_L7N/T1/AD2N) U201.J8(.PWR:GND) U201.J10(.PWR:GND) U201.J12(.PWR:GND) U201.J18(.PWR:GND) U201.K5(.PWR:GND) U201.K7(.PWR:GND) U201.K9(.PWR:GNDADC) U201.K11(.PWR:GND) U201.K15(.PWR:GND) U201.L2(.PWR:GND) U201.L8(.PWR:GND) U201.L9(.BANK0-XADC:VREFN) U201.L10(.BANK0-XADC:VP) U201.L22(.PWR:GND) U201.M7(.PWR:GND) U201.M9(.BANK0-XADC:VN) U201.M10(.BANK0-XADC:VREFP) U201.M11(.PWR:GND) U201.M19(.PWR:GND) U201.M20(.BANK15:IO_L18N/T2/A23) U201.M21(.BANK15:IO_L10P/T1/AD11P) U201.N6(.PWR:GND) U201.N8(.PWR:GND) U201.N9(.BANK0-CFG:DXN) U201.N10(.BANK0-CFG:DXP) U201.N16(.PWR:GND) U201.P3(.PWR:GND) U201.P7(.PWR:GND) U201.P9(.PWR:GND) U201.P11(.PWR:GND) U201.P13(.PWR:GND) U201.R8(.PWR:GND) U201.R10(.PWR:GND) U201.R12(.PWR:GND) U201.R20(.PWR:GND) U201.T7(.PWR:GND) U201.T9(.PWR:GND) U201.T11(.PWR:GND) U201.T17(.PWR:GND) U201.U4(.PWR:GND) U201.U10(.BANK0-CFG:M1) U201.U14(.PWR:GND) U201.U22(.BANK14:IO_L3P/T0_DQS/!PUDC) U201.V1(.PWR:GND) U201.V11(.PWR:GND) U201.V21(.PWR:GND) U201.W8(.PWR:GND) U201.W18(.PWR:GND) U201.Y5(.PWR:GND) U201.Y15(.PWR:GND) U202.4(GND) ; also sheet 1,3,4,5,6,7,8,9,10,11,12
N$31: R210.1 U201.F8(.PWR:MGTRREF)
N$35: JP202.5 R213.1
N$37: JP201.6 R206.1
N$41: JP202.4 R209.1
N$43: JP202.3 R212.1
N$45: JP202.2 R208.1
N$46: JP202.1 R211.1
N$51: JP201.4 R204.1
N$53: JP201.2 R203.1
PM_I2C_EN: U201.AA18(.BANK14:IO_L17P/T2/A14/D30) ; also sheet 10
SYNTH_CE: U201.Y17(.BANK13:IO_0) ; also sheet 6
SYNTH_LD: U201.AB20(.BANK14:IO_L15N/T2_DQS/!CSO!/DOUT) ; also sheet 6
SYNTH_MUTE: U201.AB21(.BANK14:IO_L10P/T1/D14) ; also sheet 6
SYNTH_SPI_MISO: U201.AB18(.BANK14:IO_L17N/T2/A13/D29) ; also sheet 6
SYNTH_SPI_MOSI: U201.AB17(.BANK13:IO_L2N/T0) ; also sheet 6
SYNTH_SPI_SCK: U201.AA19(.BANK14:IO_L15P/T2_DQS/RD/!WR) ; also sheet 6
SYNTH_SYNC: U201.AB16(.BANK13:IO_L2P/T0) ; also sheet 6
SYS_I2C_SCL: R202.1 U201.Y22(.BANK14:IO_L9N/T1_DQS/D13) ; also sheet 9,10
SYS_I2C_SDA: R201.1 U201.AB22(.BANK14:IO_L10N/T1/D15) ; also sheet 9,10
TRX_CLK_OUT: U201.J20(.BANK15:IO_L11P/T1/SRCC) ; also sheet 4
TRX_CTRL_IN0: U201.M15(.BANK15:IO_L24P/T3/RS1) ; also sheet 4
TRX_CTRL_IN1: U201.N18(.BANK15:IO_L17P/T2/A26) ; also sheet 4
TRX_CTRL_IN2: U201.N20(.BANK15:IO_L18P/T2/A24) ; also sheet 4
TRX_CTRL_IN3: U201.N19(.BANK15:IO_L17N/T2/A25) ; also sheet 4
TRX_CTRL_OUT0: U201.N22(.BANK15:IO_L15P/T2_DQS) ; also sheet 4
TRX_CTRL_OUT1: U201.D22(.BANK16:IO_L22N/T3) ; also sheet 4
TRX_CTRL_OUT2: U201.D21(.BANK16:IO_L23N/T3) ; also sheet 4
TRX_CTRL_OUT3: U201.D17(.BANK16:IO_L12P/T1/MRCC) ; also sheet 4
TRX_CTRL_OUT4: U201.G22(.BANK16:IO_L24N/T3) ; also sheet 4
TRX_CTRL_OUT5: U201.E21(.BANK16:IO_L23P/T3) ; also sheet 4
TRX_CTRL_OUT6: U201.D19(.BANK16:IO_L14N/T2/SRCC) ; also sheet 4
TRX_CTRL_OUT7: U201.E19(.BANK16:IO_L14P/T2/SRCC) ; also sheet 4
TRX_DATA_CLK: U201.K18(.BANK15:IO_L13P/T2/MRCC) ; also sheet 4
TRX_EN_AGC: U201.F15(.BANK16:IO_0) ; also sheet 4
TRX_ENABLE: U201.F16(.BANK16:IO_L2P/T0) ; also sheet 4
TRX_FB_CLK: U201.J19(.BANK15:IO_L12P/T1/MRCC) ; also sheet 4
TRX_P0_D0: U201.L16(.BANK15:IO_L23P/T3/!FOE) ; also sheet 4
TRX_P0_D1: U201.L13(.BANK15:IO_L20N/T3/A19) ; also sheet 4
TRX_P0_D2: U201.L15(.BANK15:IO_L22N/T3/A16) ; also sheet 4
TRX_P0_D3: U201.M13(.BANK15:IO_L20P/T3/A20) ; also sheet 4
TRX_P0_D4: U201.L14(.BANK15:IO_L22P/T3/A17) ; also sheet 4
TRX_P0_D5: U201.M18(.BANK15:IO_L16P/T2/A28) ; also sheet 4
TRX_P0_D6: U201.L18(.BANK15:IO_L16N/T2/A27) ; also sheet 4
TRX_P0_D7: U201.M17(.BANK15:IO_25) ; also sheet 4
TRX_P0_D8: U201.L19(.BANK15:IO_L14P/T2/SRCC) ; also sheet 4
TRX_P0_D9: U201.M16(.BANK15:IO_L24N/T3/RS0) ; also sheet 4
TRX_P0_D10: U201.L21(.BANK15:IO_L10N/T1/AD11N) ; also sheet 4
TRX_P0_D11: U201.L20(.BANK15:IO_L14N/T2/SRCC) ; also sheet 4
TRX_P1_D0: U201.H14(.BANK15:IO_L3N/T0_DQS/AD1N) ; also sheet 4
TRX_P1_D1: U201.K14(.BANK15:IO_L19N/T3/VREF/A21) ; also sheet 4
TRX_P1_D2: U201.H15(.BANK15:IO_L5N/T0/AD9N) ; also sheet 4
TRX_P1_D3: U201.K13(.BANK15:IO_L19P/T3/A22) ; also sheet 4
TRX_P1_D4: U201.H17(.BANK15:IO_L6P/T0) ; also sheet 4
TRX_P1_D5: U201.H13(.BANK15:IO_L1P/T0/AD0P) ; also sheet 4
TRX_P1_D6: U201.H18(.BANK15:IO_L6N/T0/VREF) ; also sheet 4
TRX_P1_D7: U201.K16(.BANK15:IO_L23N/T3/!FWE) ; also sheet 4
TRX_P1_D8: U201.G21(.BANK16:IO_L24P/T3) ; also sheet 4
TRX_P1_D9: U201.K17(.BANK15:IO_L21P/T3_DQS) ; also sheet 4
TRX_P1_D10: U201.J22(.BANK15:IO_L7P/T1/AD2P) ; also sheet 4
TRX_P1_D11: U201.J21(.BANK15:IO_L11N/T1/SRCC) ; also sheet 4
TRX_RX_FRAME: U201.K22(.BANK15:IO_L9N/T1_DQS/AD3N) ; also sheet 4
TRX_SPI_MISO: U201.G18(.BANK15:IO_L4N/T0) ; also sheet 4
TRX_SPI_MOSI: U201.G17(.BANK15:IO_L4P/T0) ; also sheet 4
TRX_SPI_SCK: U201.G15(.BANK15:IO_L2P/T0/AD8P) ; also sheet 4
TRX_SYNC_IN: U201.F18(.BANK16:IO_L15P/T2_DQS) ; also sheet 4
TRX_TX/!RX: U201.F14(.BANK16:IO_L1N/T0) ; also sheet 4
TRX_TX_FRAME: U201.K21(.BANK15:IO_L9P/T1_DQS/AD3P) ; also sheet 4
Unconnected: TC201.5 TC201.7 U201.AA21(.BANK14:IO_L8N/T1/D12) U201.AB12(.BANK13:IO_L7N/T1) U201.AB15(.BANK13:IO_L4N/T0) U201.B13(.BANK16:IO_L8N/T1) U201.B15(.BANK16:IO_L7P/T1) U201.B16(.BANK16:IO_L7N/T1) U201.B17(.BANK16:IO_L11P/T1/SRCC) U201.B18(.BANK16:IO_L11N/T1/SRCC) U201.B20(.BANK16:IO_L16P/T2) U201.B21(.BANK16:IO_L21P/T3_DQS) U201.B22(.BANK16:IO_L20N/T3) U201.C13(.BANK16:IO_L8P/T1) U201.C14(.BANK16:IO_L3P/T0_DQS) U201.C15(.BANK16:IO_L3N/T0_DQS) U201.C17(.BANK16:IO_L12N/T1/MRCC) U201.C18(.BANK16:IO_L13P/T2/MRCC) U201.C19(.BANK16:IO_L13N/T2/MRCC) U201.C20(.BANK16:IO_L19N/T3/VREF) U201.C22(.BANK16:IO_L20P/T3) U201.D14(.BANK16:IO_L6P/T0) U201.D15(.BANK16:IO_L6N/T0/VREF) U201.D16(.BANK16:IO_L5N/T0) U201.D20(.BANK16:IO_L19P/T3) U201.E13(.BANK16:IO_L4P/T0) U201.E14(.BANK16:IO_L4N/T0) U201.E16(.BANK16:IO_L5P/T0) U201.E17(.BANK16:IO_L2N/T0) U201.E18(.BANK16:IO_L15N/T2_DQS) U201.E22(.BANK16:IO_L22P/T3) U201.F13(.BANK16:IO_L1P/T0) U201.F19(.BANK16:IO_L18P/T2) U201.G20(.BANK15:IO_L8N/T1/AD10N) U201.J14(.BANK15:IO_L3P/T0_DQS/AD1P) U201.J15(.BANK15:IO_L5P/T0/AD9P) U201.J16(.BANK15:IO_0) U201.J17(.BANK15:IO_L21N/T3_DQS/A18) U201.K19(.BANK15:IO_L13N/T2/MRCC) U201.M22(.BANK15:IO_L15N/T2_DQS/!ADV) U201.N14(.BANK14:IO_L23N/T3/A2/D18) U201.N15(.BANK14:IO_25) U201.N17(.BANK14:IO_L21P/T3_DQS) U201.P14(.BANK14:IO_L19P/T3/A10/D26) U201.P15(.BANK14:IO_L22P/T3/A5/D21) U201.P16(.BANK14:IO_L24P/T3/A1/D17) U201.P17(.BANK14:IO_L21N/T3_DQS/A6/D22) U201.P19(.BANK14:IO_L5P/T0/D6) U201.P20(.BANK14:IO_0) U201.R14(.BANK14:IO_L19N/T3/VREF/A9/D25) U201.R16(.BANK14:IO_L22N/T3/A4/D20) U201.R17(.BANK14:IO_L24N/T3/A0/D16) U201.R18(.BANK14:IO_L20P/T3/A8/D24) U201.R19(.BANK14:IO_L5N/T0/D7) U201.T14(.BANK13:IO_L15P/T2_DQS) U201.T15(.BANK13:IO_L15N/T2_DQS) U201.T16(.BANK13:IO_L17P/T2) U201.T18(.BANK14:IO_L20N/T3/A7/D23) U201.T21(.BANK14:IO_L4P/T0/D4) U201.U15(.BANK13:IO_L14P/T2/SRCC) U201.U16(.BANK13:IO_L17N/T2) U201.U17(.BANK14:IO_L18P/T2/A12/D28) U201.U18(.BANK14:IO_L18N/T2/A11/D27) U201.U20(.BANK14:IO_L11P/T1/SRCC) U201.V10(.BANK13:IO_L10P/T1) U201.V14(.BANK13:IO_L13N/T2/MRCC) U201.V15(.BANK13:IO_L14N/T2/SRCC) U201.V18(.BANK14:IO_L14P/T2/SRCC) U201.V19(.BANK14:IO_L14N/T2/SRCC) U201.W10(.BANK13:IO_L10N/T1) U201.W12(.BANK13:IO_L12N/T1/MRCC) U201.W14(.BANK13:IO_L6P/T0) U201.Y11(.BANK13:IO_L11P/T1/SRCC) U201.Y12(.BANK13:IO_L11N/T1/SRCC) U201.Y13(.BANK13:IO_L5P/T0) U201.Y14(.BANK13:IO_L6N/T0/VREF) U201.Y16(.BANK13:IO_L1P/T0) U201.Y21(.BANK14:IO_L9P/T1_DQS)

### Notes on the sheet
- Pullups as per Xillinx recommendation
- VCCINT
- Flash SCK is connected to CCLK for initial 
  configuration, and also to a dedicated IO,
  to be used in the design at full speed.
- VCCBRAM | VCCAUX | VCCO_0 | MGTAVTT | MGTAVCC
- INIT LED should light up
  after FPGA housekeeping
  (during configuration)
- DONE LED should light up
  after FPGA configuration.
  DONE LED is also controllable
  through STARTUPE2 primitive
- VCCO_13 | VCCO_14
- CFGBVS = 1 -> Bank 0 at 3V3
- M[2:0] = 0b001 -> Boot from SPI Flash
  M[2:0] = 0b101 -> Boot from JTAG
- VCCO_15 | VCCO_16
- VCCO_34 | VCCO_35
- 2V5
- 3V3
- Pullups as per Xillinx recommendation
- 3V3
- 2V5

## Sheet 3 of 13: DDR3
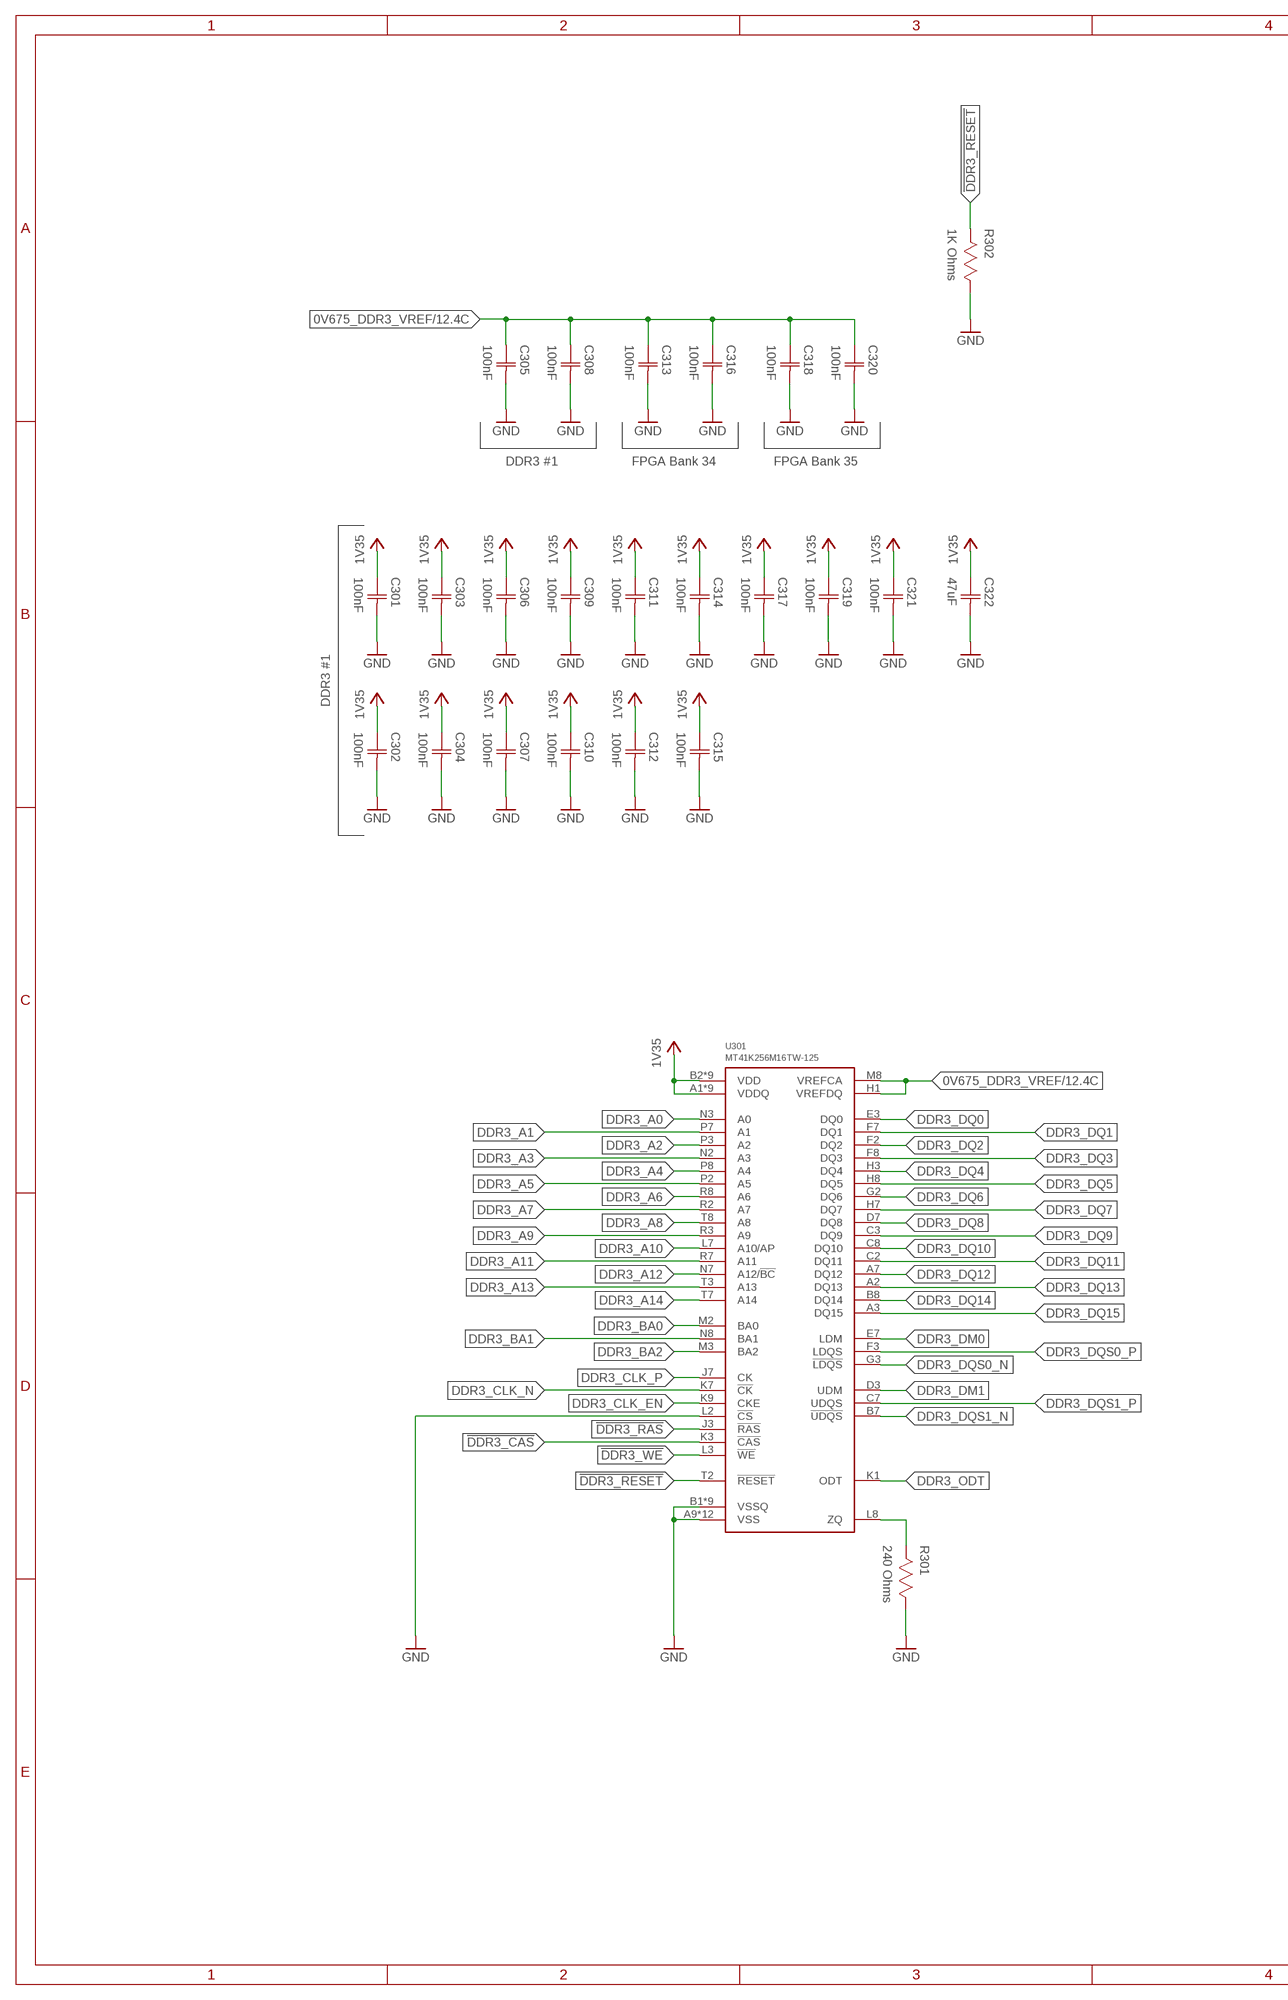
[diagram p4: schematic, sheet 3, part 1 of 2]
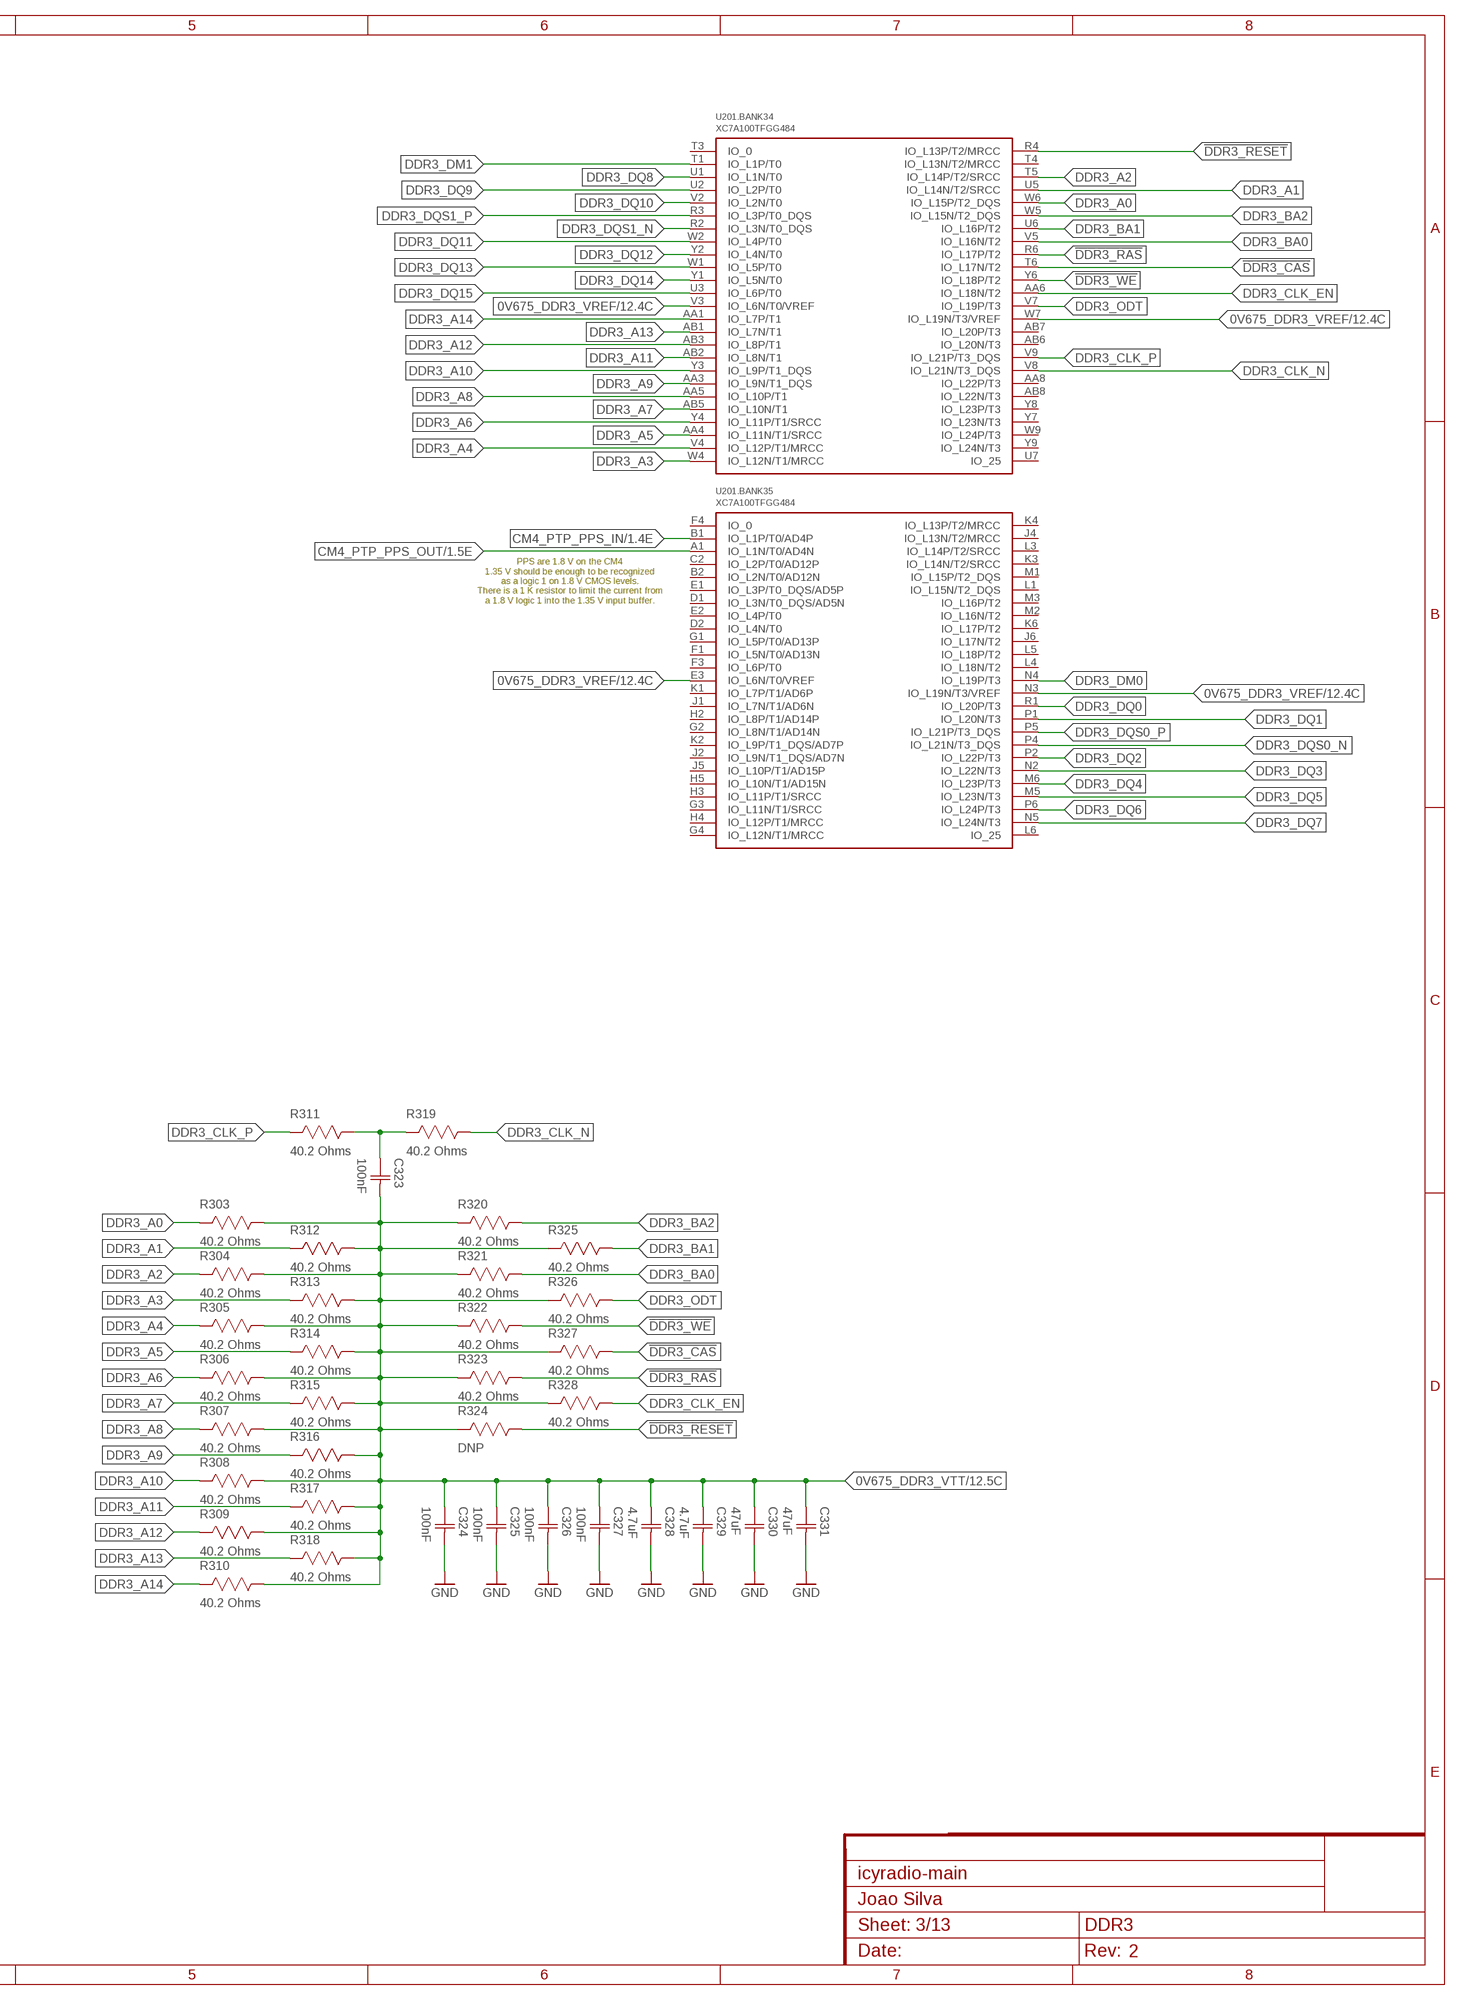
[diagram p5: schematic, sheet 3, part 2 of 2]

### Parts
C301  100nF  CAPACITOR-0402  [CAP0402]
C302  100nF  CAPACITOR-0402  [CAP0402]
C303  100nF  CAPACITOR-0402  [CAP0402]
C304  100nF  CAPACITOR-0402  [CAP0402]
C305  100nF  CAPACITOR-0402  [CAP0402]
C306  100nF  CAPACITOR-0402  [CAP0402]
C307  100nF  CAPACITOR-0402  [CAP0402]
C308  100nF  CAPACITOR-0402  [CAP0402]
C309  100nF  CAPACITOR-0402  [CAP0402]
C310  100nF  CAPACITOR-0402  [CAP0402]
C311  100nF  CAPACITOR-0402  [CAP0402]
C312  100nF  CAPACITOR-0402  [CAP0402]
C313  100nF  CAPACITOR-0402  [CAP0402]
C314  100nF  CAPACITOR-0402  [CAP0402]
C315  100nF  CAPACITOR-0402  [CAP0402]
C316  100nF  CAPACITOR-0402  [CAP0402]
C317  100nF  CAPACITOR-0402  [CAP0402]
C318  100nF  CAPACITOR-0402  [CAP0402]
C319  100nF  CAPACITOR-0402  [CAP0402]
C320  100nF  CAPACITOR-0402  [CAP0402]
C321  100nF  CAPACITOR-0402  [CAP0402]
C322  47uF  CAPACITOR-0603  [CAP0603]
C323  100nF  CAPACITOR-0402  [CAP0402]
C324  100nF  CAPACITOR-0402  [CAP0402]
C325  100nF  CAPACITOR-0402  [CAP0402]
C326  100nF  CAPACITOR-0402  [CAP0402]
C327  100nF  CAPACITOR-0402  [CAP0402]
C328  4.7uF  CAPACITOR-0402  [CAP0402]
C329  4.7uF  CAPACITOR-0402  [CAP0402]
C330  47uF  CAPACITOR-0603  [CAP0603]
C331  47uF  CAPACITOR-0603  [CAP0603]
R301  240 Ohms  RESISTOR-0402  [RES0402]
R302  1K Ohms  RESISTOR-0402  [RES0402]
R303  40.2 Ohms  RESISTOR-0402  [RES0402]
R304  40.2 Ohms  RESISTOR-0402  [RES0402]
R305  40.2 Ohms  RESISTOR-0402  [RES0402]
R306  40.2 Ohms  RESISTOR-0402  [RES0402]
R307  40.2 Ohms  RESISTOR-0402  [RES0402]
R308  40.2 Ohms  RESISTOR-0402  [RES0402]
R309  40.2 Ohms  RESISTOR-0402  [RES0402]
R310  40.2 Ohms  RESISTOR-0402  [RES0402]
R311  40.2 Ohms  RESISTOR-0402  [RES0402]
R312  40.2 Ohms  RESISTOR-0402  [RES0402]
R313  40.2 Ohms  RESISTOR-0402  [RES0402]
R314  40.2 Ohms  RESISTOR-0402  [RES0402]
R315  40.2 Ohms  RESISTOR-0402  [RES0402]
R316  40.2 Ohms  RESISTOR-0402  [RES0402]
R317  40.2 Ohms  RESISTOR-0402  [RES0402]
R318  40.2 Ohms  RESISTOR-0402  [RES0402]
R319  40.2 Ohms  RESISTOR-0402  [RES0402]
R320  40.2 Ohms  RESISTOR-0402  [RES0402]
R321  40.2 Ohms  RESISTOR-0402  [RES0402]
R322  40.2 Ohms  RESISTOR-0402  [RES0402]
R323  40.2 Ohms  RESISTOR-0402  [RES0402]
R324  DNP  RESISTOR-0402  [RES0402]
R325  40.2 Ohms  RESISTOR-0402  [RES0402]
R326  40.2 Ohms  RESISTOR-0402  [RES0402]
R327  40.2 Ohms  RESISTOR-0402  [RES0402]
R328  40.2 Ohms  RESISTOR-0402  [RES0402]
U301  MT41K256M16TW-125  [FBGA96_14X8]

### Nets
0V675_DDR3_VREF: C305.1(C1) C308.1(C1) C313.1(C1) C316.1(C1) C318.1(C1) C320.1(C1) U201.E3(.BANK35:IO_L6N/T0/VREF) U201.N3(.BANK35:IO_L19N/T3/VREF) U201.V3(.BANK34:IO_L6N/T0/VREF) U201.W7(.BANK34:IO_L19N/T3/VREF) U301.H1(VREFDQ) U301.M8(VREFCA) ; also sheet 12
0V675_DDR3_VTT: C323.2(C2) C324.1(C1) C325.1(C1) C326.1(C1) C327.1(C1) C328.1(C1) C329.1(C1) C330.1(C1) C331.1(C1) R303.1 R304.1 R305.1 R306.1 R307.1 R308.1 R309.1 R310.1 R312.1 R313.1 R314.1 R315.1 R316.1 R317.1 R318.1 R320.2 R321.2 R322.2 R323.2 R324.2 R325.2 R326.2 R327.2 R328.2 ; also sheet 12
1V35: C301.1(C1) C302.1(C1) C303.1(C1) C304.1(C1) C306.1(C1) C307.1(C1) C309.1(C1) C310.1(C1) C311.1(C1) C312.1(C1) C314.1(C1) C315.1(C1) C317.1(C1) C319.1(C1) C321.1(C1) C322.1(C1) U301.A1(VDDQ) U301.A8(VDDQ) U301.B2(VDD) U301.C1(VDDQ) U301.C9(VDDQ) U301.D2(VDDQ) U301.D9(VDD) U301.E9(VDDQ) U301.F1(VDDQ) U301.G7(VDD) U301.H2(VDDQ) U301.H9(VDDQ) U301.K2(VDD) U301.K8(VDD) U301.N1(VDD) U301.N9(VDD) U301.R1(VDD) U301.R9(VDD) ; also sheet 2,12
!DDR3_CAS [Stripline 50 Ohm Single-Ended]: R327.1 U201.T6(.BANK34:IO_L17N/T2) U301.K3(!CAS)
!DDR3_RAS [Stripline 50 Ohm Single-Ended]: R323.1 U201.R6(.BANK34:IO_L17P/T2) U301.J3(!RAS)
!DDR3_RESET [Stripline 50 Ohm Single-Ended]: R302.2 R324.1 U201.R4(.BANK34:IO_L13P/T2/MRCC) U301.T2(!RESET)
!DDR3_WE [Stripline 50 Ohm Single-Ended]: R322.1 U201.Y6(.BANK34:IO_L18P/T2) U301.L3(!WE)
CM4_PTP_PPS_IN: U201.B1(.BANK35:IO_L1P/T0/AD4P) ; also sheet 1
CM4_PTP_PPS_OUT: U201.A1(.BANK35:IO_L1N/T0/AD4N) ; also sheet 1
DDR3_A0 [Stripline 50 Ohm Single-Ended]: R303.2 U201.W6(.BANK34:IO_L15P/T2_DQS) U301.N3(A0)
DDR3_A1 [Stripline 50 Ohm Single-Ended]: R312.2 U201.U5(.BANK34:IO_L14N/T2/SRCC) U301.P7(A1)
DDR3_A2 [Stripline 50 Ohm Single-Ended]: R304.2 U201.T5(.BANK34:IO_L14P/T2/SRCC) U301.P3(A2)
DDR3_A3 [Stripline 50 Ohm Single-Ended]: R313.2 U201.W4(.BANK34:IO_L12N/T1/MRCC) U301.N2(A3)
DDR3_A4 [Stripline 50 Ohm Single-Ended]: R305.2 U201.V4(.BANK34:IO_L12P/T1/MRCC) U301.P8(A4)
DDR3_A5 [Stripline 50 Ohm Single-Ended]: R314.2 U201.AA4(.BANK34:IO_L11N/T1/SRCC) U301.P2(A5)
DDR3_A6 [Stripline 50 Ohm Single-Ended]: R306.2 U201.Y4(.BANK34:IO_L11P/T1/SRCC) U301.R8(A6)
DDR3_A7 [Stripline 50 Ohm Single-Ended]: R315.2 U201.AB5(.BANK34:IO_L10N/T1) U301.R2(A7)
DDR3_A8 [Stripline 50 Ohm Single-Ended]: R307.2 U201.AA5(.BANK34:IO_L10P/T1) U301.T8(A8)
DDR3_A9 [Stripline 50 Ohm Single-Ended]: R316.2 U201.AA3(.BANK34:IO_L9N/T1_DQS) U301.R3(A9)
DDR3_A10 [Stripline 50 Ohm Single-Ended]: R308.2 U201.Y3(.BANK34:IO_L9P/T1_DQS) U301.L7(A10/AP)
DDR3_A11 [Stripline 50 Ohm Single-Ended]: R317.2 U201.AB2(.BANK34:IO_L8N/T1) U301.R7(A11)
DDR3_A12 [Stripline 50 Ohm Single-Ended]: R309.2 U201.AB3(.BANK34:IO_L8P/T1) U301.N7(A12/!BC)
DDR3_A13 [Stripline 50 Ohm Single-Ended]: R318.2 U201.AB1(.BANK34:IO_L7N/T1) U301.T3(A13)
DDR3_A14 [Stripline 50 Ohm Single-Ended]: R310.2 U201.AA1(.BANK34:IO_L7P/T1) U301.T7(A14)
DDR3_BA0 [Stripline 50 Ohm Single-Ended]: R321.1 U201.V5(.BANK34:IO_L16N/T2) U301.M2(BA0)
DDR3_BA1 [Stripline 50 Ohm Single-Ended]: R325.1 U201.U6(.BANK34:IO_L16P/T2) U301.N8(BA1)
DDR3_BA2 [Stripline 50 Ohm Single-Ended]: R320.1 U201.W5(.BANK34:IO_L15N/T2_DQS) U301.M3(BA2)
DDR3_CLK_EN [Stripline 50 Ohm Single-Ended]: R328.1 U201.AA6(.BANK34:IO_L18N/T2) U301.K9(CKE)
DDR3_CLK_N [Stripline 100 Ohm Differential]: R319.1 U201.V8(.BANK34:IO_L21N/T3_DQS) U301.K7(!CK)
DDR3_CLK_P [Stripline 100 Ohm Differential]: R311.2 U201.V9(.BANK34:IO_L21P/T3_DQS) U301.J7(CK)
DDR3_DM0 [Stripline 50 Ohm Single-Ended]: U201.N4(.BANK35:IO_L19P/T3) U301.E7(LDM)
DDR3_DM1 [Stripline 50 Ohm Single-Ended]: U201.T1(.BANK34:IO_L1P/T0) U301.D3(UDM)
DDR3_DQ0 [Stripline 50 Ohm Single-Ended]: U201.R1(.BANK35:IO_L20P/T3) U301.E3(DQ0)
DDR3_DQ1 [Stripline 50 Ohm Single-Ended]: U201.P1(.BANK35:IO_L20N/T3) U301.F7(DQ1)
DDR3_DQ2 [Stripline 50 Ohm Single-Ended]: U201.P2(.BANK35:IO_L22P/T3) U301.F2(DQ2)
DDR3_DQ3 [Stripline 50 Ohm Single-Ended]: U201.N2(.BANK35:IO_L22N/T3) U301.F8(DQ3)
DDR3_DQ4 [Stripline 50 Ohm Single-Ended]: U201.M6(.BANK35:IO_L23P/T3) U301.H3(DQ4)
DDR3_DQ5 [Stripline 50 Ohm Single-Ended]: U201.M5(.BANK35:IO_L23N/T3) U301.H8(DQ5)
DDR3_DQ6 [Stripline 50 Ohm Single-Ended]: U201.P6(.BANK35:IO_L24P/T3) U301.G2(DQ6)
DDR3_DQ7 [Stripline 50 Ohm Single-Ended]: U201.N5(.BANK35:IO_L24N/T3) U301.H7(DQ7)
DDR3_DQ8 [Stripline 50 Ohm Single-Ended]: U201.U1(.BANK34:IO_L1N/T0) U301.D7(DQ8)
DDR3_DQ9 [Stripline 50 Ohm Single-Ended]: U201.U2(.BANK34:IO_L2P/T0) U301.C3(DQ9)
DDR3_DQ10 [Stripline 50 Ohm Single-Ended]: U201.V2(.BANK34:IO_L2N/T0) U301.C8(DQ10)
DDR3_DQ11 [Stripline 50 Ohm Single-Ended]: U201.W2(.BANK34:IO_L4P/T0) U301.C2(DQ11)
DDR3_DQ12 [Stripline 50 Ohm Single-Ended]: U201.Y2(.BANK34:IO_L4N/T0) U301.A7(DQ12)
DDR3_DQ13 [Stripline 50 Ohm Single-Ended]: U201.W1(.BANK34:IO_L5P/T0) U301.A2(DQ13)
DDR3_DQ14 [Stripline 50 Ohm Single-Ended]: U201.Y1(.BANK34:IO_L5N/T0) U301.B8(DQ14)
DDR3_DQ15 [Stripline 50 Ohm Single-Ended]: U201.U3(.BANK34:IO_L6P/T0) U301.A3(DQ15)
DDR3_DQS0_N [Stripline 100 Ohm Differential]: U201.P4(.BANK35:IO_L21N/T3_DQS) U301.G3(!LDQS)
DDR3_DQS0_P [Stripline 100 Ohm Differential]: U201.P5(.BANK35:IO_L21P/T3_DQS) U301.F3(LDQS)
DDR3_DQS1_N [Stripline 100 Ohm Differential]: U201.R2(.BANK34:IO_L3N/T0_DQS) U301.B7(!UDQS)
DDR3_DQS1_P [Stripline 100 Ohm Differential]: U201.R3(.BANK34:IO_L3P/T0_DQS) U301.C7(UDQS)
DDR3_ODT [Stripline 50 Ohm Single-Ended]: R326.1 U201.V7(.BANK34:IO_L19P/T3) U301.K1(ODT)
GND: C301.2(C2) C302.2(C2) C303.2(C2) C304.2(C2) C305.2(C2) C306.2(C2) C307.2(C2) C308.2(C2) C309.2(C2) C310.2(C2) C311.2(C2) C312.2(C2) C313.2(C2) C314.2(C2) C315.2(C2) C316.2(C2) C317.2(C2) C318.2(C2) C319.2(C2) C320.2(C2) C321.2(C2) C322.2(C2) C324.2(C2) C325.2(C2) C326.2(C2) C327.2(C2) C328.2(C2) C329.2(C2) C330.2(C2) C331.2(C2) R301.1 R302.1 U301.A9(VSS) U301.B1(VSSQ) U301.B3(VSS) U301.B9(VSSQ) U301.D1(VSSQ) U301.D8(VSSQ) U301.E1(VSS) U301.E2(VSSQ) U301.E8(VSSQ) U301.F9(VSSQ) U301.G1(VSSQ) U301.G8(VSS) U301.G9(VSSQ) U301.J2(VSS) U301.J8(VSS) U301.L2(!CS) U301.M1(VSS) U301.M9(VSS) U301.P1(VSS) U301.P9(VSS) U301.T1(VSS) U301.T9(VSS) ; also sheet 1,2,4,5,6,7,8,9,10,11,12
N$73: R301.2 U301.L8(ZQ)
N$87: C323.1(C1) R311.1 R319.2
Unconnected: U201.AA8(.BANK34:IO_L22P/T3) U201.AB6(.BANK34:IO_L20N/T3) U201.AB7(.BANK34:IO_L20P/T3) U201.AB8(.BANK34:IO_L22N/T3) U201.B2(.BANK35:IO_L2N/T0/AD12N) U201.C2(.BANK35:IO_L2P/T0/AD12P) U201.D1(.BANK35:IO_L3N/T0_DQS/AD5N) U201.D2(.BANK35:IO_L4N/T0) U201.E1(.BANK35:IO_L3P/T0_DQS/AD5P) U201.E2(.BANK35:IO_L4P/T0) U201.F1(.BANK35:IO_L5N/T0/AD13N) U201.F3(.BANK35:IO_L6P/T0) U201.F4(.BANK35:IO_0) U201.G1(.BANK35:IO_L5P/T0/AD13P) U201.G2(.BANK35:IO_L8N/T1/AD14N) U201.G3(.BANK35:IO_L11N/T1/SRCC) U201.G4(.BANK35:IO_L12N/T1/MRCC) U201.H2(.BANK35:IO_L8P/T1/AD14P) U201.H3(.BANK35:IO_L11P/T1/SRCC) U201.H4(.BANK35:IO_L12P/T1/MRCC) U201.H5(.BANK35:IO_L10N/T1/AD15N) U201.J1(.BANK35:IO_L7N/T1/AD6N) U201.J2(.BANK35:IO_L9N/T1_DQS/AD7N) U201.J4(.BANK35:IO_L13N/T2/MRCC) U201.J5(.BANK35:IO_L10P/T1/AD15P) U201.J6(.BANK35:IO_L17N/T2) U201.K1(.BANK35:IO_L7P/T1/AD6P) U201.K2(.BANK35:IO_L9P/T1_DQS/AD7P) U201.K3(.BANK35:IO_L14N/T2/SRCC) U201.K4(.BANK35:IO_L13P/T2/MRCC) U201.K6(.BANK35:IO_L17P/T2) U201.L1(.BANK35:IO_L15N/T2_DQS) U201.L3(.BANK35:IO_L14P/T2/SRCC) U201.L4(.BANK35:IO_L18N/T2) U201.L5(.BANK35:IO_L18P/T2) U201.L6(.BANK35:IO_25) U201.M1(.BANK35:IO_L15P/T2_DQS) U201.M2(.BANK35:IO_L16N/T2) U201.M3(.BANK35:IO_L16P/T2) U201.T3(.BANK34:IO_0) U201.T4(.BANK34:IO_L13N/T2/MRCC) U201.U7(.BANK34:IO_25) U201.W9(.BANK34:IO_L24P/T3) U201.Y7(.BANK34:IO_L23N/T3) U201.Y8(.BANK34:IO_L23P/T3) U201.Y9(.BANK34:IO_L24N/T3)

### Notes on the sheet
- DDR3 #1 | FPGA Bank 34 | FPGA Bank 35
- PPS are 1.8 V on the CM4
  1.35 V should be enough to be recognized
  as a logic 1 on 1.8 V CMOS levels.
  There is a 1 K resistor to limit the current from
  a 1.8 V logic 1 into the 1.35 V input buffer.
- DDR3 #1

## Sheet 4 of 13: RF Transceiver
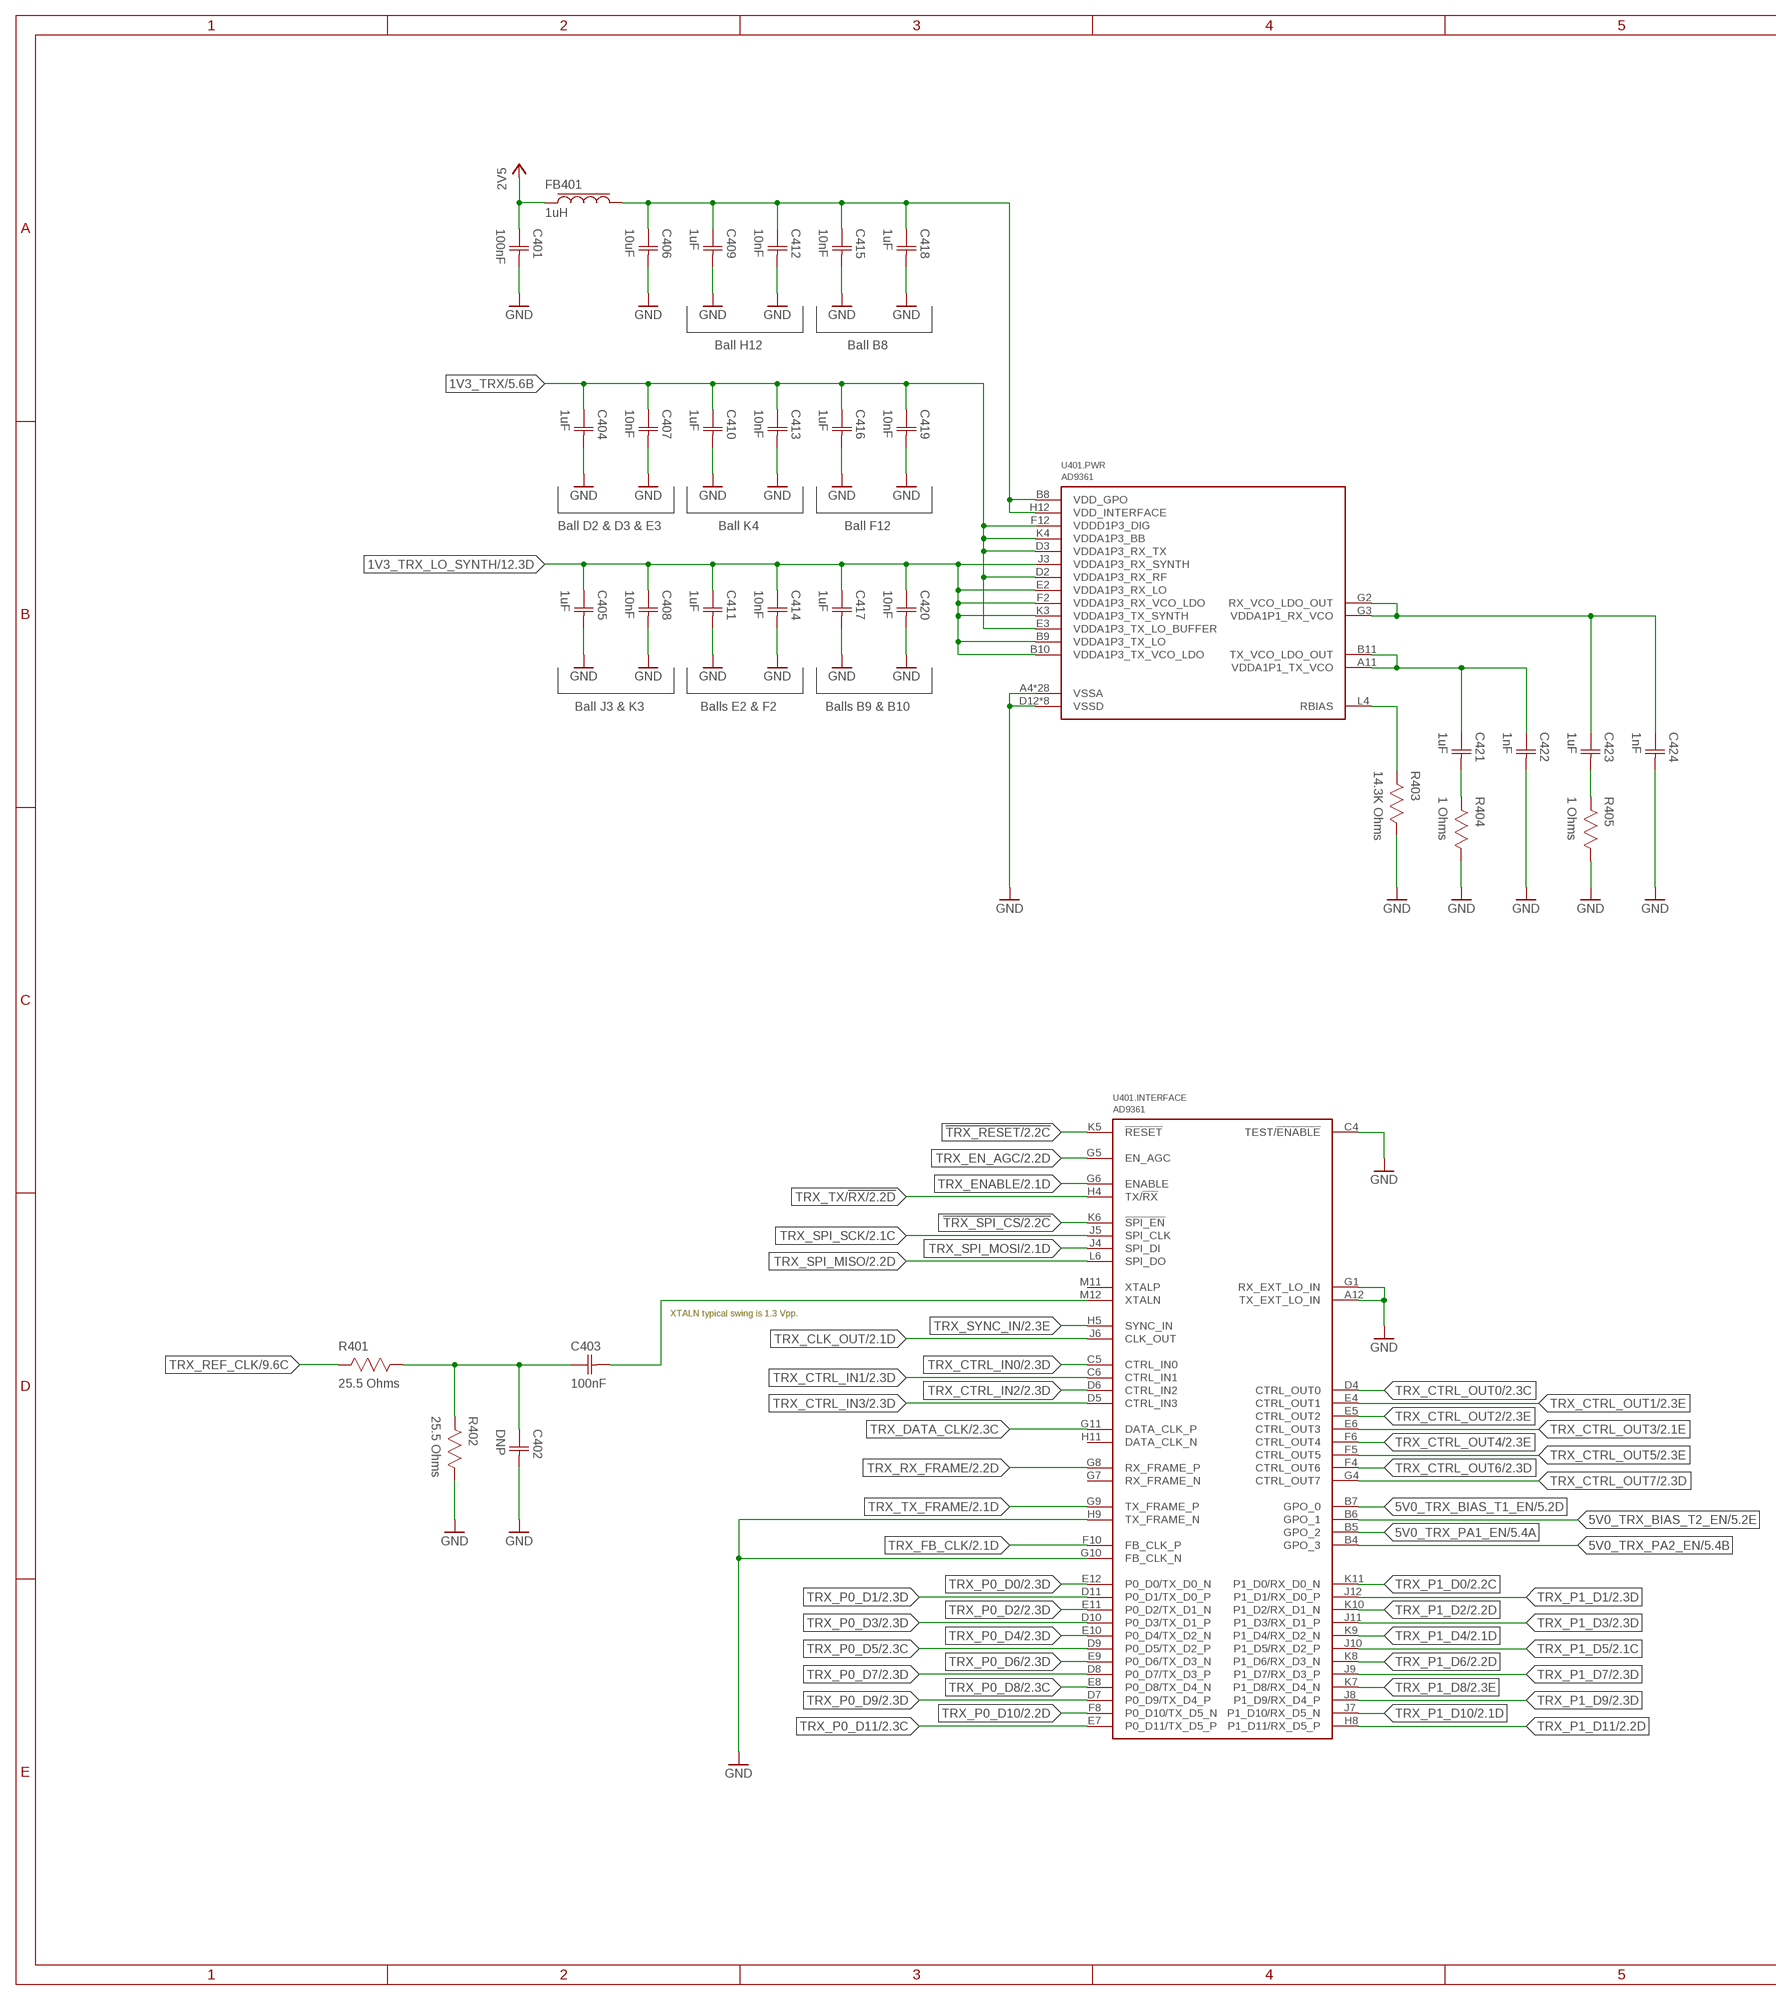
[diagram p6: schematic, sheet 4, part 1 of 2]
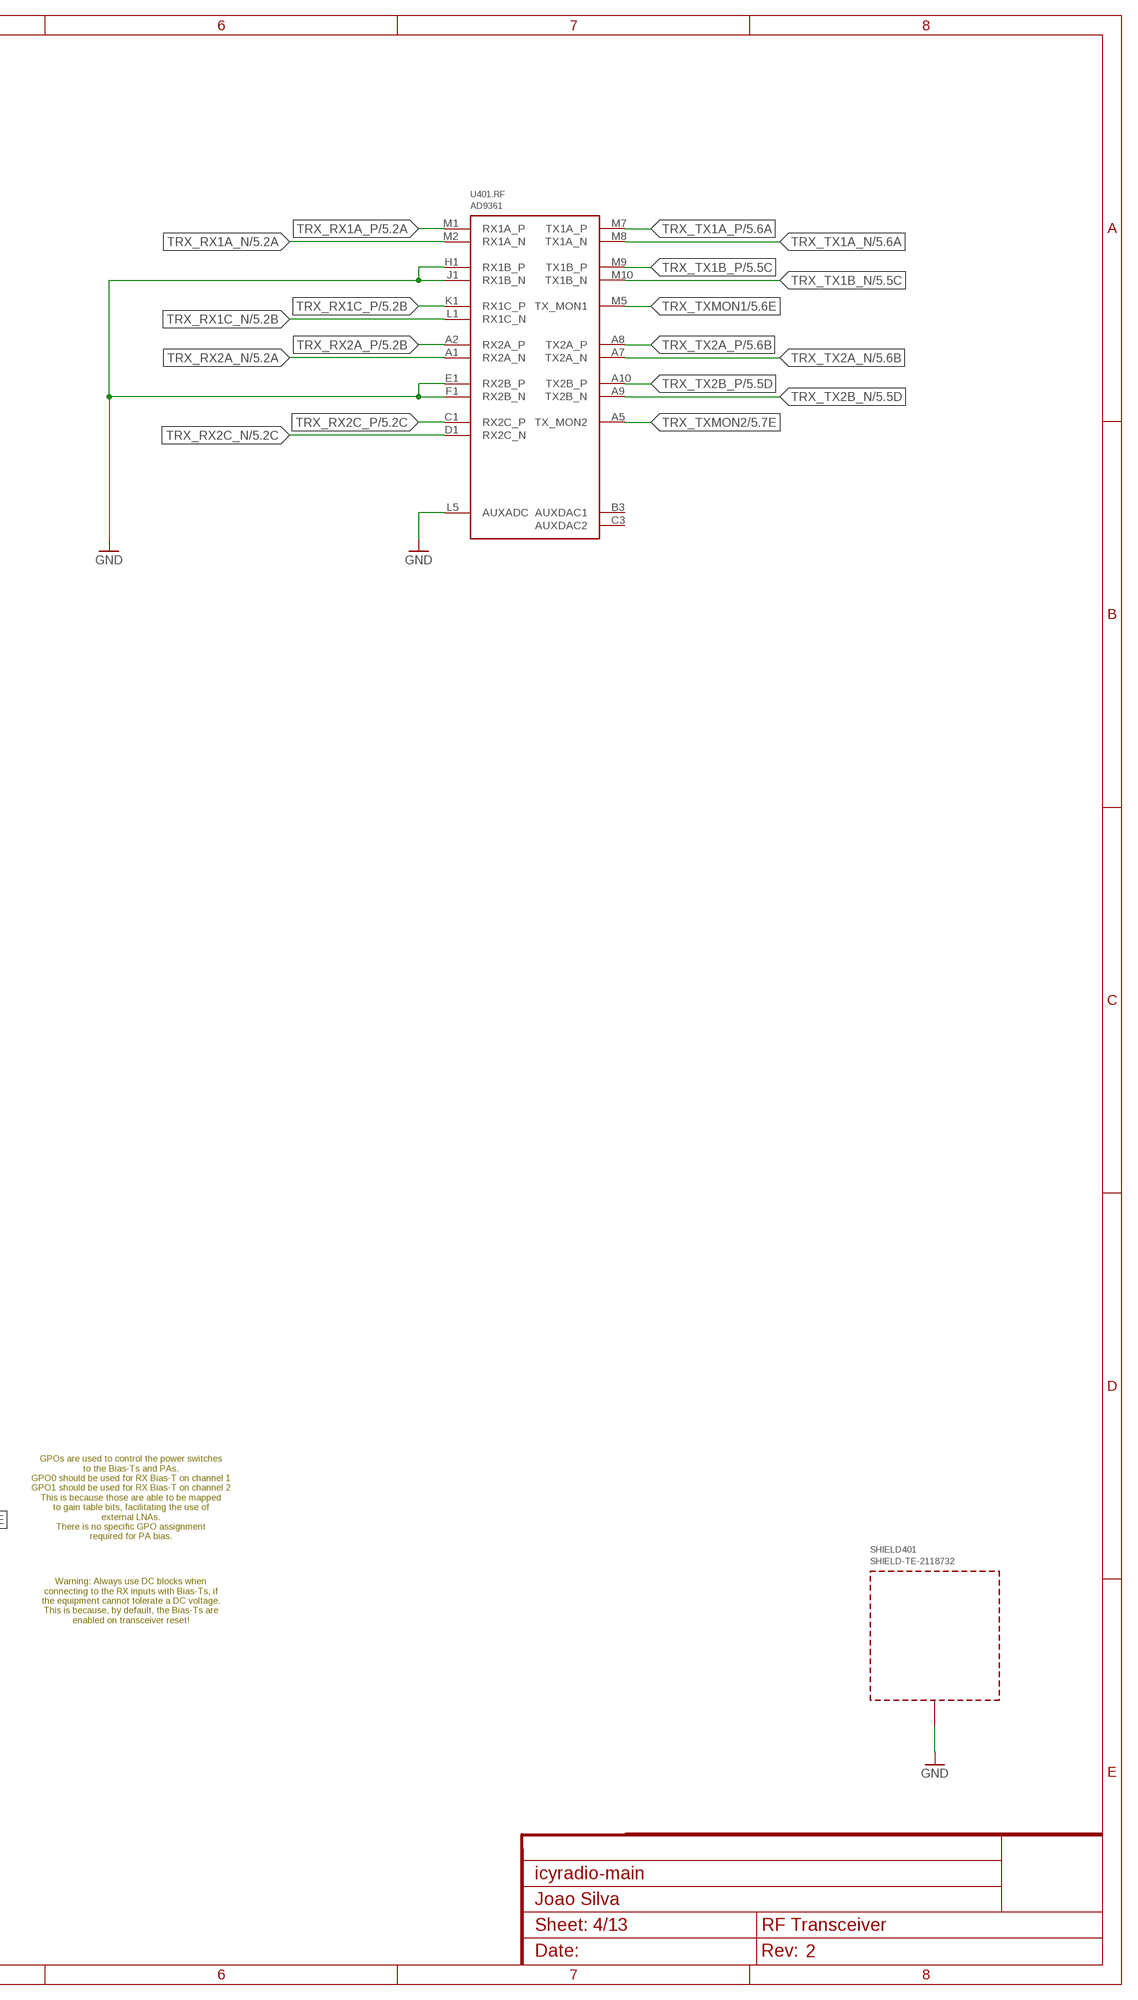
[diagram p7: schematic, sheet 4, part 2 of 2]

### Parts
C401  100nF  CAPACITOR-0402  [CAP0402]
C402  DNP  CAPACITOR-0402  [CAP0402]
C403  100nF  CAPACITOR-0402  [CAP0402]
C404  1uF  CAPACITOR-0402  [CAP0402]
C405  1uF  CAPACITOR-0402  [CAP0402]
C406  10uF  CAPACITOR-0402  [CAP0402]
C407  10nF  CAPACITOR-0402  [CAP0402]
C408  10nF  CAPACITOR-0402  [CAP0402]
C409  1uF  CAPACITOR-0402  [CAP0402]
C410  1uF  CAPACITOR-0402  [CAP0402]
C411  1uF  CAPACITOR-0402  [CAP0402]
C412  10nF  CAPACITOR-0402  [CAP0402]
C413  10nF  CAPACITOR-0402  [CAP0402]
C414  10nF  CAPACITOR-0402  [CAP0402]
C415  10nF  CAPACITOR-0402  [CAP0402]
C416  1uF  CAPACITOR-0402  [CAP0402]
C417  1uF  CAPACITOR-0402  [CAP0402]
C418  1uF  CAPACITOR-0402  [CAP0402]
C419  10nF  CAPACITOR-0402  [CAP0402]
C420  10nF  CAPACITOR-0402  [CAP0402]
C421  1uF  CAPACITOR-0402  [CAP0402]
C422  1nF  CAPACITOR-0402  [CAP0402]
C423  1uF  CAPACITOR-0402  [CAP0402]
C424  1nF  CAPACITOR-0402  [CAP0402]
FB401  1uH  FERRITE-0603  [IND0603]
R401  25.5 Ohms  RESISTOR-0402  [RES0402]
R402  25.5 Ohms  RESISTOR-0402  [RES0402]
R403  14.3K Ohms  RESISTOR-0402  [RES0402]
R404  1 Ohms  RESISTOR-0402  [RES0402]
R405  1 Ohms  RESISTOR-0402  [RES0402]
SHIELD401  SHIELD-TE-2118732  [2118732]
U401  AD9361  [BGA144]

### Nets
1V1_TRX_RX_VCO: C423.1(C1) C424.1(C1) U401.G2(.PWR:RX_VCO_LDO_OUT) U401.G3(.PWR:VDDA1P1_RX_VCO)
1V1_TRX_TX_VCO: C421.1(C1) C422.1(C1) U401.A11(.PWR:VDDA1P1_TX_VCO) U401.B11(.PWR:TX_VCO_LDO_OUT)
1V3_TRX: C404.1(C1) C407.1(C1) C410.1(C1) C413.1(C1) C416.1(C1) C419.1(C1) U401.D2(.PWR:VDDA1P3_RX_RF) U401.D3(.PWR:VDDA1P3_RX_TX) U401.E3(.PWR:VDDA1P3_TX_LO_BUFFER) U401.F12(.PWR:VDDD1P3_DIG) U401.K4(.PWR:VDDA1P3_BB) ; also sheet 5,12
1V3_TRX_LO_SYNTH: C405.1(C1) C408.1(C1) C411.1(C1) C414.1(C1) C417.1(C1) C420.1(C1) U401.B9(.PWR:VDDA1P3_TX_LO) U401.B10(.PWR:VDDA1P3_TX_VCO_LDO) U401.E2(.PWR:VDDA1P3_RX_LO) U401.F2(.PWR:VDDA1P3_RX_VCO_LDO) U401.J3(.PWR:VDDA1P3_RX_SYNTH) U401.K3(.PWR:VDDA1P3_TX_SYNTH) ; also sheet 12
2V5: C401.1(C1) FB401.1 ; also sheet 2,5,11,12
2V5_TRX_INTF_GPO_AUXDAC: C406.1(C1) C409.1(C1) C412.1(C1) C415.1(C1) C418.1(C1) FB401.2 U401.B8(.PWR:VDD_GPO) U401.H12(.PWR:VDD_INTERFACE)
5V0_TRX_BIAS_T1_EN: U401.B7(.INTERFACE:GPO_0) ; also sheet 5
5V0_TRX_BIAS_T2_EN: U401.B6(.INTERFACE:GPO_1) ; also sheet 5
5V0_TRX_PA1_EN: U401.B5(.INTERFACE:GPO_2) ; also sheet 5
5V0_TRX_PA2_EN: U401.B4(.INTERFACE:GPO_3) ; also sheet 5
!TRX_RESET: U401.K5(.INTERFACE:!RESET) ; also sheet 2
!TRX_SPI_CS: U401.K6(.INTERFACE:!SPI_EN) ; also sheet 2
GND: C401.2(C2) C402.2(C2) C404.2(C2) C405.2(C2) C406.2(C2) C407.2(C2) C408.2(C2) C409.2(C2) C410.2(C2) C411.2(C2) C412.2(C2) C413.2(C2) C414.2(C2) C415.2(C2) C416.2(C2) C417.2(C2) C418.2(C2) C419.2(C2) C420.2(C2) C422.2(C2) C424.2(C2) R402.1 R403.1 R404.1 R405.1 SHIELD401.1(GND) SHIELD401.2(GND) SHIELD401.3(GND) SHIELD401.4(GND) SHIELD401.5(GND) SHIELD401.6(GND) SHIELD401.7(GND) SHIELD401.8(GND) SHIELD401.9(GND) SHIELD401.10(GND) SHIELD401.11(GND) SHIELD401.12(GND) SHIELD401.13(GND) SHIELD401.14(GND) SHIELD401.15(GND) SHIELD401.16(GND) SHIELD401.17(GND) SHIELD401.18(GND) SHIELD401.19(GND) SHIELD401.20(GND) SHIELD401.21(GND) SHIELD401.22(GND) SHIELD401.23(GND) SHIELD401.24(GND) SHIELD401.25(GND) SHIELD401.26(GND) SHIELD401.27(GND) SHIELD401.28(GND) SHIELD401.29(GND) SHIELD401.30(GND) SHIELD401.31(GND) SHIELD401.32(GND) U401.A4(.PWR:VSSA) U401.A6(.PWR:VSSA) U401.A12(.INTERFACE:TX_EXT_LO_IN) U401.B1(.PWR:VSSA) U401.B2(.PWR:VSSA) U401.B12(.PWR:VSSA) U401.C2(.PWR:VSSA) U401.C4(.INTERFACE:TEST/!ENABLE) U401.C7(.PWR:VSSA) U401.C8(.PWR:VSSA) U401.C9(.PWR:VSSA) U401.C10(.PWR:VSSA) U401.C11(.PWR:VSSA) U401.C12(.PWR:VSSA) U401.D12(.PWR:VSSD) U401.E1(.RF:RX2B_P) U401.F1(.RF:RX2B_N) U401.F3(.PWR:VSSA) U401.F7(.PWR:VSSD) U401.F9(.PWR:VSSD) U401.F11(.PWR:VSSD) U401.G1(.INTERFACE:RX_EXT_LO_IN) U401.G10(.INTERFACE:FB_CLK_N) U401.G12(.PWR:VSSD) U401.H1(.RF:RX1B_P) U401.H2(.PWR:VSSA) U401.H3(.PWR:VSSA) U401.H6(.PWR:VSSA) U401.H7(.PWR:VSSD) U401.H9(.INTERFACE:TX_FRAME_N) U401.H10(.PWR:VSSD) U401.J1(.RF:RX1B_N) U401.J2(.PWR:VSSA) U401.K2(.PWR:VSSA) U401.K12(.PWR:VSSD) U401.L2(.PWR:VSSA) U401.L3(.PWR:VSSA) U401.L5(.RF:AUXADC) U401.L7(.PWR:VSSA) U401.L8(.PWR:VSSA) U401.L9(.PWR:VSSA) U401.L10(.PWR:VSSA) U401.L11(.PWR:VSSA) U401.L12(.PWR:VSSA) U401.M4(.PWR:VSSA) U401.M6(.PWR:VSSA) ; also sheet 1,2,3,5,6,7,8,9,10,11,12
N$8: R403.2 U401.L4(.PWR:RBIAS)
N$12: C421.2(C2) R404.2
N$29: C423.2(C2) R405.2
TRX_CLK_OUT: U401.J6(.INTERFACE:CLK_OUT) ; also sheet 2
TRX_CTRL_IN0: U401.C5(.INTERFACE:CTRL_IN0) ; also sheet 2
TRX_CTRL_IN1: U401.C6(.INTERFACE:CTRL_IN1) ; also sheet 2
TRX_CTRL_IN2: U401.D6(.INTERFACE:CTRL_IN2) ; also sheet 2
TRX_CTRL_IN3: U401.D5(.INTERFACE:CTRL_IN3) ; also sheet 2
TRX_CTRL_OUT0: U401.D4(.INTERFACE:CTRL_OUT0) ; also sheet 2
TRX_CTRL_OUT1: U401.E4(.INTERFACE:CTRL_OUT1) ; also sheet 2
TRX_CTRL_OUT2: U401.E5(.INTERFACE:CTRL_OUT2) ; also sheet 2
TRX_CTRL_OUT3: U401.E6(.INTERFACE:CTRL_OUT3) ; also sheet 2
TRX_CTRL_OUT4: U401.F6(.INTERFACE:CTRL_OUT4) ; also sheet 2
TRX_CTRL_OUT5: U401.F5(.INTERFACE:CTRL_OUT5) ; also sheet 2
TRX_CTRL_OUT6: U401.F4(.INTERFACE:CTRL_OUT6) ; also sheet 2
TRX_CTRL_OUT7: U401.G4(.INTERFACE:CTRL_OUT7) ; also sheet 2
TRX_DATA_CLK: U401.G11(.INTERFACE:DATA_CLK_P) ; also sheet 2
TRX_EN_AGC: U401.G5(.INTERFACE:EN_AGC) ; also sheet 2
TRX_ENABLE: U401.G6(.INTERFACE:ENABLE) ; also sheet 2
TRX_FB_CLK: U401.F10(.INTERFACE:FB_CLK_P) ; also sheet 2
TRX_P0_D0: U401.E12(.INTERFACE:P0_D0/TX_D0_N) ; also sheet 2
TRX_P0_D1: U401.D11(.INTERFACE:P0_D1/TX_D0_P) ; also sheet 2
TRX_P0_D2: U401.E11(.INTERFACE:P0_D2/TX_D1_N) ; also sheet 2
TRX_P0_D3: U401.D10(.INTERFACE:P0_D3/TX_D1_P) ; also sheet 2
TRX_P0_D4: U401.E10(.INTERFACE:P0_D4/TX_D2_N) ; also sheet 2
TRX_P0_D5: U401.D9(.INTERFACE:P0_D5/TX_D2_P) ; also sheet 2
TRX_P0_D6: U401.E9(.INTERFACE:P0_D6/TX_D3_N) ; also sheet 2
TRX_P0_D7: U401.D8(.INTERFACE:P0_D7/TX_D3_P) ; also sheet 2
TRX_P0_D8: U401.E8(.INTERFACE:P0_D8/TX_D4_N) ; also sheet 2
TRX_P0_D9: U401.D7(.INTERFACE:P0_D9/TX_D4_P) ; also sheet 2
TRX_P0_D10: U401.F8(.INTERFACE:P0_D10/TX_D5_N) ; also sheet 2
TRX_P0_D11: U401.E7(.INTERFACE:P0_D11/TX_D5_P) ; also sheet 2
TRX_P1_D0: U401.K11(.INTERFACE:P1_D0/RX_D0_N) ; also sheet 2
TRX_P1_D1: U401.J12(.INTERFACE:P1_D1/RX_D0_P) ; also sheet 2
TRX_P1_D2: U401.K10(.INTERFACE:P1_D2/RX_D1_N) ; also sheet 2
TRX_P1_D3: U401.J11(.INTERFACE:P1_D3/RX_D1_P) ; also sheet 2
TRX_P1_D4: U401.K9(.INTERFACE:P1_D4/RX_D2_N) ; also sheet 2
TRX_P1_D5: U401.J10(.INTERFACE:P1_D5/RX_D2_P) ; also sheet 2
TRX_P1_D6: U401.K8(.INTERFACE:P1_D6/RX_D3_N) ; also sheet 2
TRX_P1_D7: U401.J9(.INTERFACE:P1_D7/RX_D3_P) ; also sheet 2
TRX_P1_D8: U401.K7(.INTERFACE:P1_D8/RX_D4_N) ; also sheet 2
TRX_P1_D9: U401.J8(.INTERFACE:P1_D9/RX_D4_P) ; also sheet 2
TRX_P1_D10: U401.J7(.INTERFACE:P1_D10/RX_D5_N) ; also sheet 2
TRX_P1_D11: U401.H8(.INTERFACE:P1_D11/RX_D5_P) ; also sheet 2
TRX_REF_CLK [CPWG 50 Ohm Single-Ended]: R401.2 ; also sheet 9
TRX_REF_CLK_DIV: C402.1(C1) C403.1(C1) R401.1 R402.2
TRX_RX1A_N [CPWG 100 Ohm Differential]: U401.M2(.RF:RX1A_N) ; also sheet 5
TRX_RX1A_P [CPWG 100 Ohm Differential]: U401.M1(.RF:RX1A_P) ; also sheet 5
TRX_RX1C_N [CPWG 100 Ohm Differential]: U401.L1(.RF:RX1C_N) ; also sheet 5
TRX_RX1C_P [CPWG 100 Ohm Differential]: U401.K1(.RF:RX1C_P) ; also sheet 5
TRX_RX2A_N [CPWG 100 Ohm Differential]: U401.A1(.RF:RX2A_N) ; also sheet 5
TRX_RX2A_P [CPWG 100 Ohm Differential]: U401.A2(.RF:RX2A_P) ; also sheet 5
TRX_RX2C_N [CPWG 100 Ohm Differential]: U401.D1(.RF:RX2C_N) ; also sheet 5
TRX_RX2C_P [CPWG 100 Ohm Differential]: U401.C1(.RF:RX2C_P) ; also sheet 5
TRX_RX_FRAME: U401.G8(.INTERFACE:RX_FRAME_P) ; also sheet 2
TRX_SPI_MISO: U401.L6(.INTERFACE:SPI_DO) ; also sheet 2
TRX_SPI_MOSI: U401.J4(.INTERFACE:SPI_DI) ; also sheet 2
TRX_SPI_SCK: U401.J5(.INTERFACE:SPI_CLK) ; also sheet 2
TRX_SYNC_IN: U401.H5(.INTERFACE:SYNC_IN) ; also sheet 2
TRX_TX1A_N [CPWG 100 Ohm Differential]: U401.M8(.RF:TX1A_N) ; also sheet 5
TRX_TX1A_P [CPWG 100 Ohm Differential]: U401.M7(.RF:TX1A_P) ; also sheet 5
TRX_TX1B_N [CPWG 100 Ohm Differential]: U401.M10(.RF:TX1B_N) ; also sheet 5
TRX_TX1B_P [CPWG 100 Ohm Differential]: U401.M9(.RF:TX1B_P) ; also sheet 5
TRX_TX2A_N [CPWG 100 Ohm Differential]: U401.A7(.RF:TX2A_N) ; also sheet 5
TRX_TX2A_P [CPWG 100 Ohm Differential]: U401.A8(.RF:TX2A_P) ; also sheet 5
TRX_TX2B_N [CPWG 100 Ohm Differential]: U401.A9(.RF:TX2B_N) ; also sheet 5
TRX_TX2B_P [CPWG 100 Ohm Differential]: U401.A10(.RF:TX2B_P) ; also sheet 5
TRX_TX/!RX: U401.H4(.INTERFACE:TX/!RX) ; also sheet 2
TRX_TX_FRAME: U401.G9(.INTERFACE:TX_FRAME_P) ; also sheet 2
TRX_TXMON1: U401.M5(.RF:TX_MON1) ; also sheet 5
TRX_TXMON2: U401.A5(.RF:TX_MON2) ; also sheet 5
TRX_XTALN: C403.2(C2) U401.M12(.INTERFACE:XTALN)
Unconnected: U401.B3(.RF:AUXDAC1) U401.C3(.RF:AUXDAC2) U401.G7(.INTERFACE:RX_FRAME_N) U401.H11(.INTERFACE:DATA_CLK_N) U401.M11(.INTERFACE:XTALP)

### Notes on the sheet
- Ball H12 | Ball B8
- Ball D2 & D3 & E3 | Ball K4 | Ball F12
- Ball J3 & K3 | Balls E2 & F2 | Balls B9 & B10
- XTALN typical swing is 1.3 Vpp.
- GPOs are used to control the power switches
  to the Bias-Ts and PAs.
  GPO0 should be used for RX Bias-T on channel 1
  GPO1 should be used for RX Bias-T on channel 2
  This is because those are able to be mapped
  to gain table bits, facilitating the use of
  external LNAs.
  There is no specific GPO assignment
  required for PA bias.
- Warning: Always use DC blocks when
  connecting to the RX inputs with Bias-Ts, if
  the equipment cannot tolerate a DC voltage.
  This is because, by default, the Bias-Ts are
  enabled on transceiver reset!